# EasyEDA Pro project ESPGI-WIN.eprj, schematic ESPGI

## Sheets
1 GTI: Board Name: ESPGI; Create Date: 2025-03-30; Page Name: GTI; Project Name: ESPGI; Schematic Name: ESPGI; Update Date: 2025-04-27; Company: b4rt; Page Size: A4; Version: V1.0
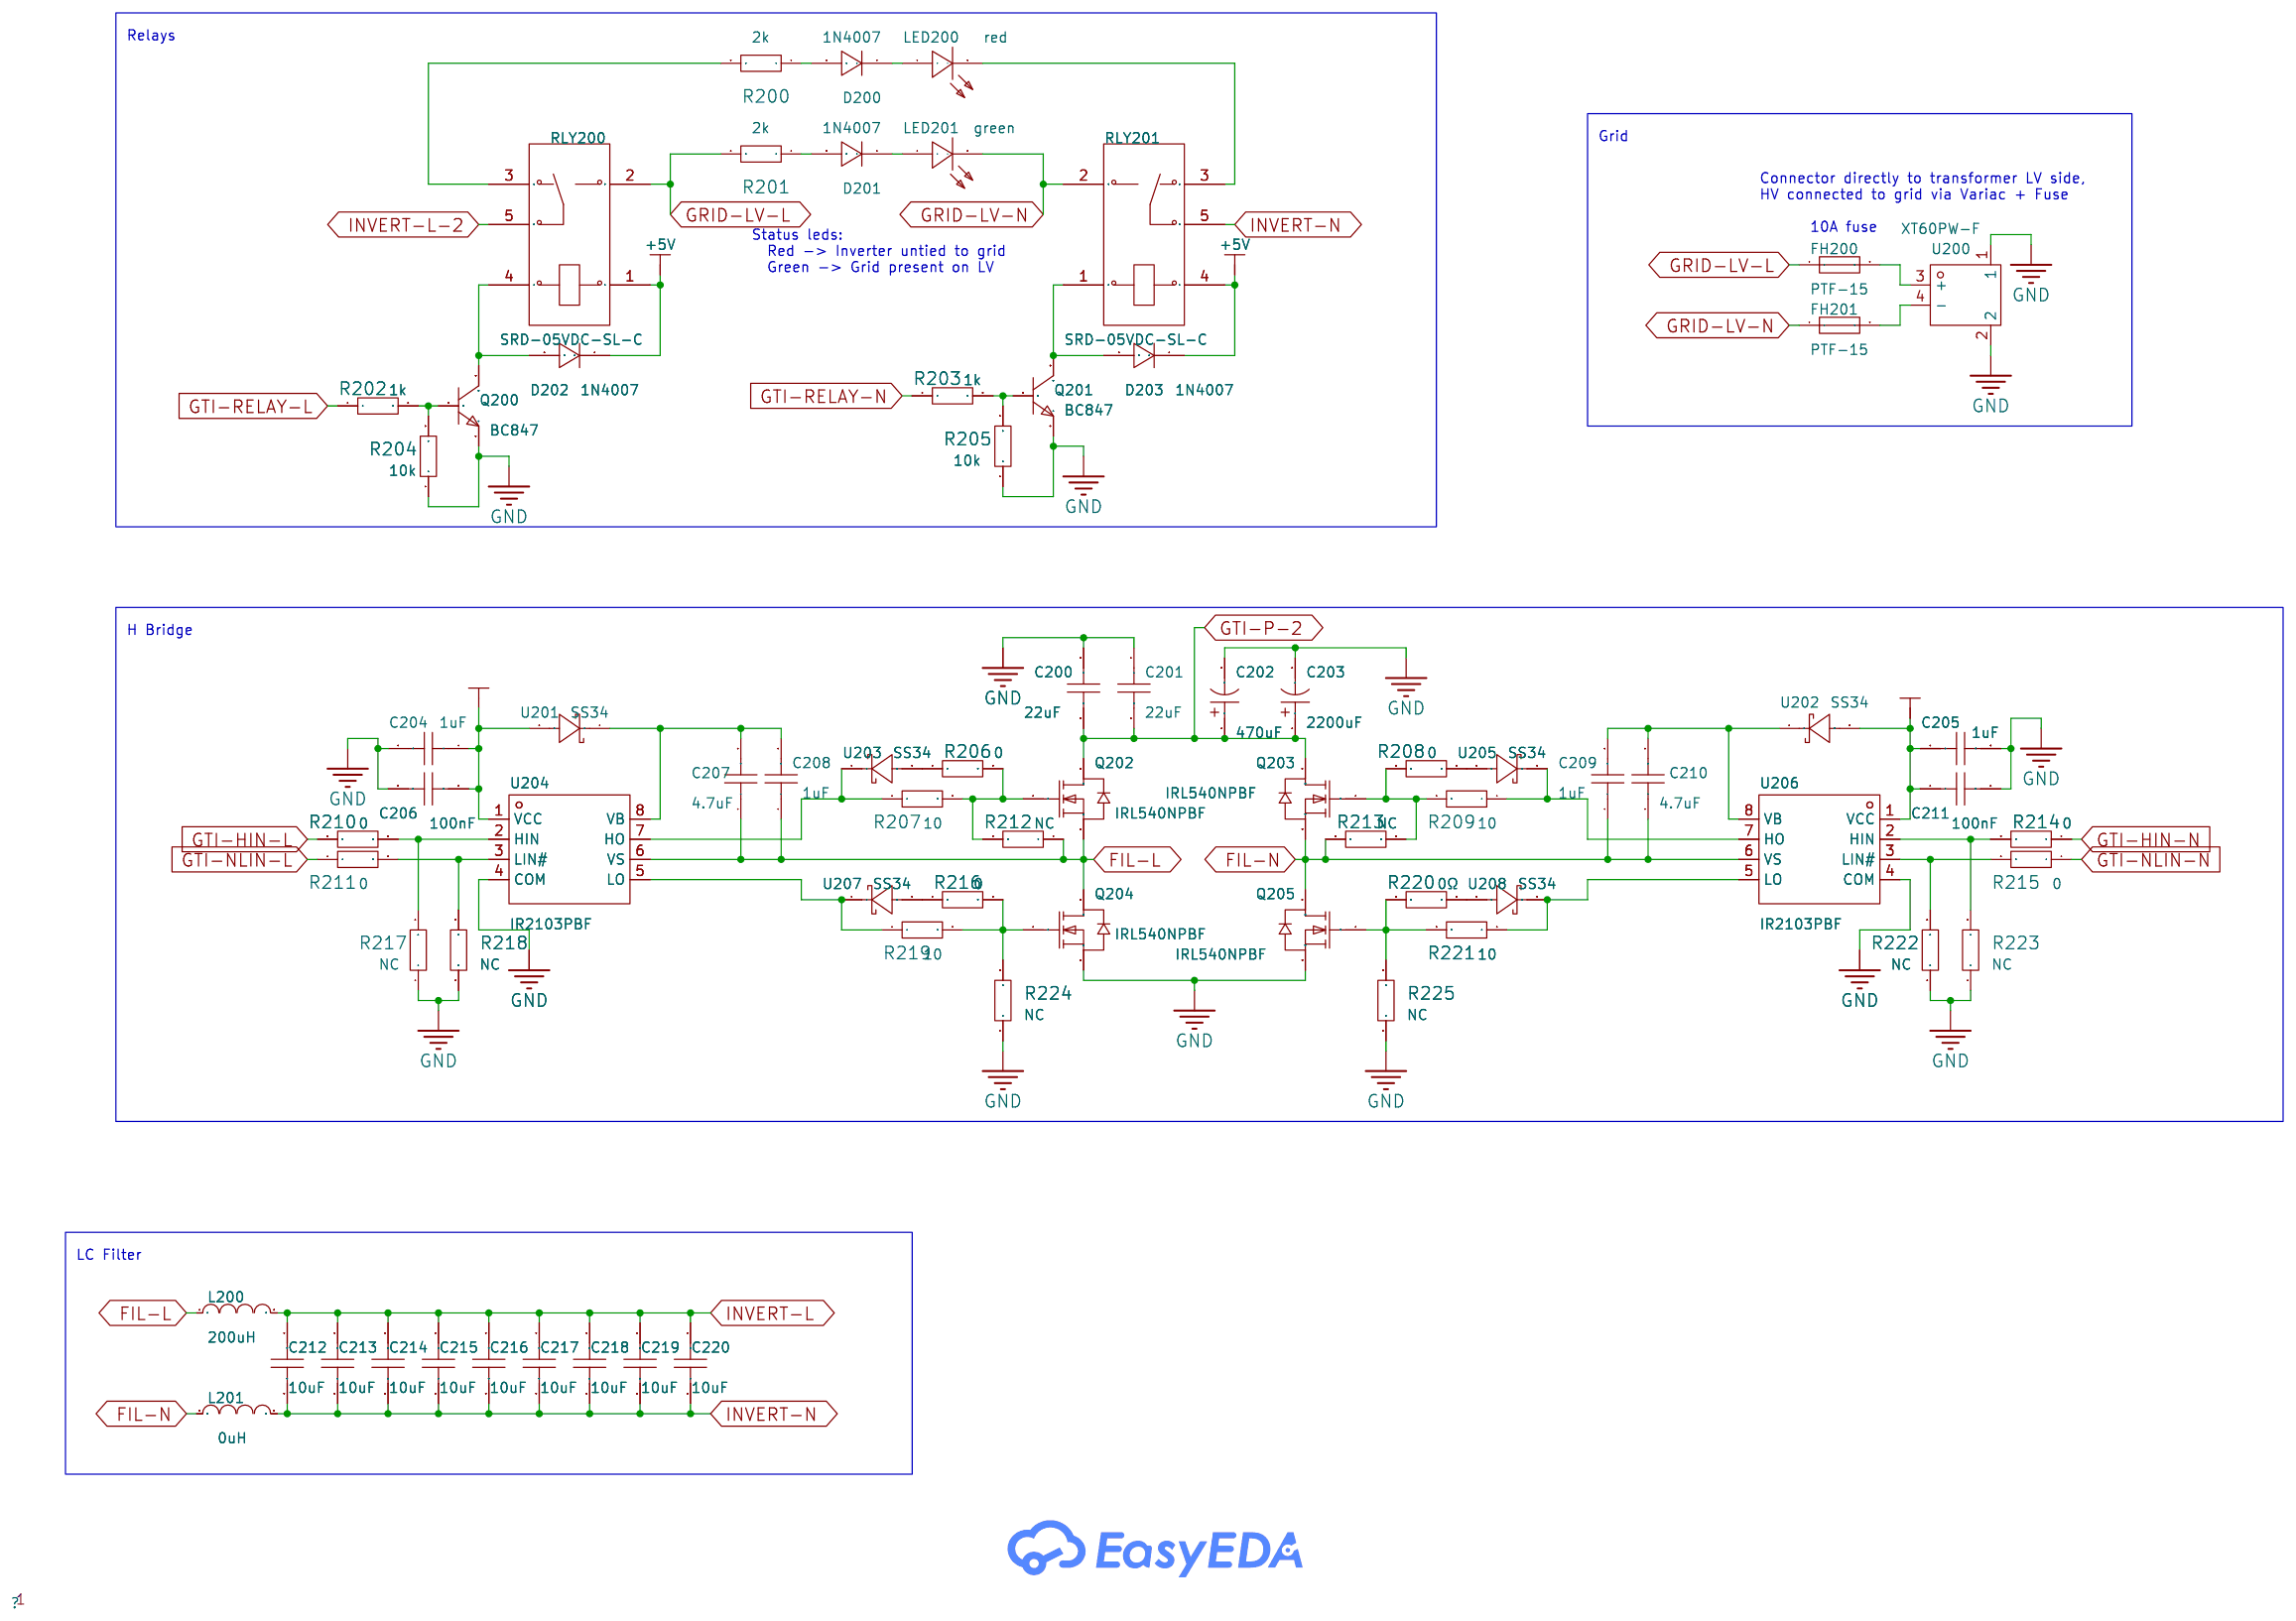
[diagram p0: GTI]
2 GTI-Sensors: Create Date: 2025-05-04; Page Name: GTI-Sensors; Project Name: ESPGI-WIN; Update Date: 2025-05-04; Company: EasyEDA.com
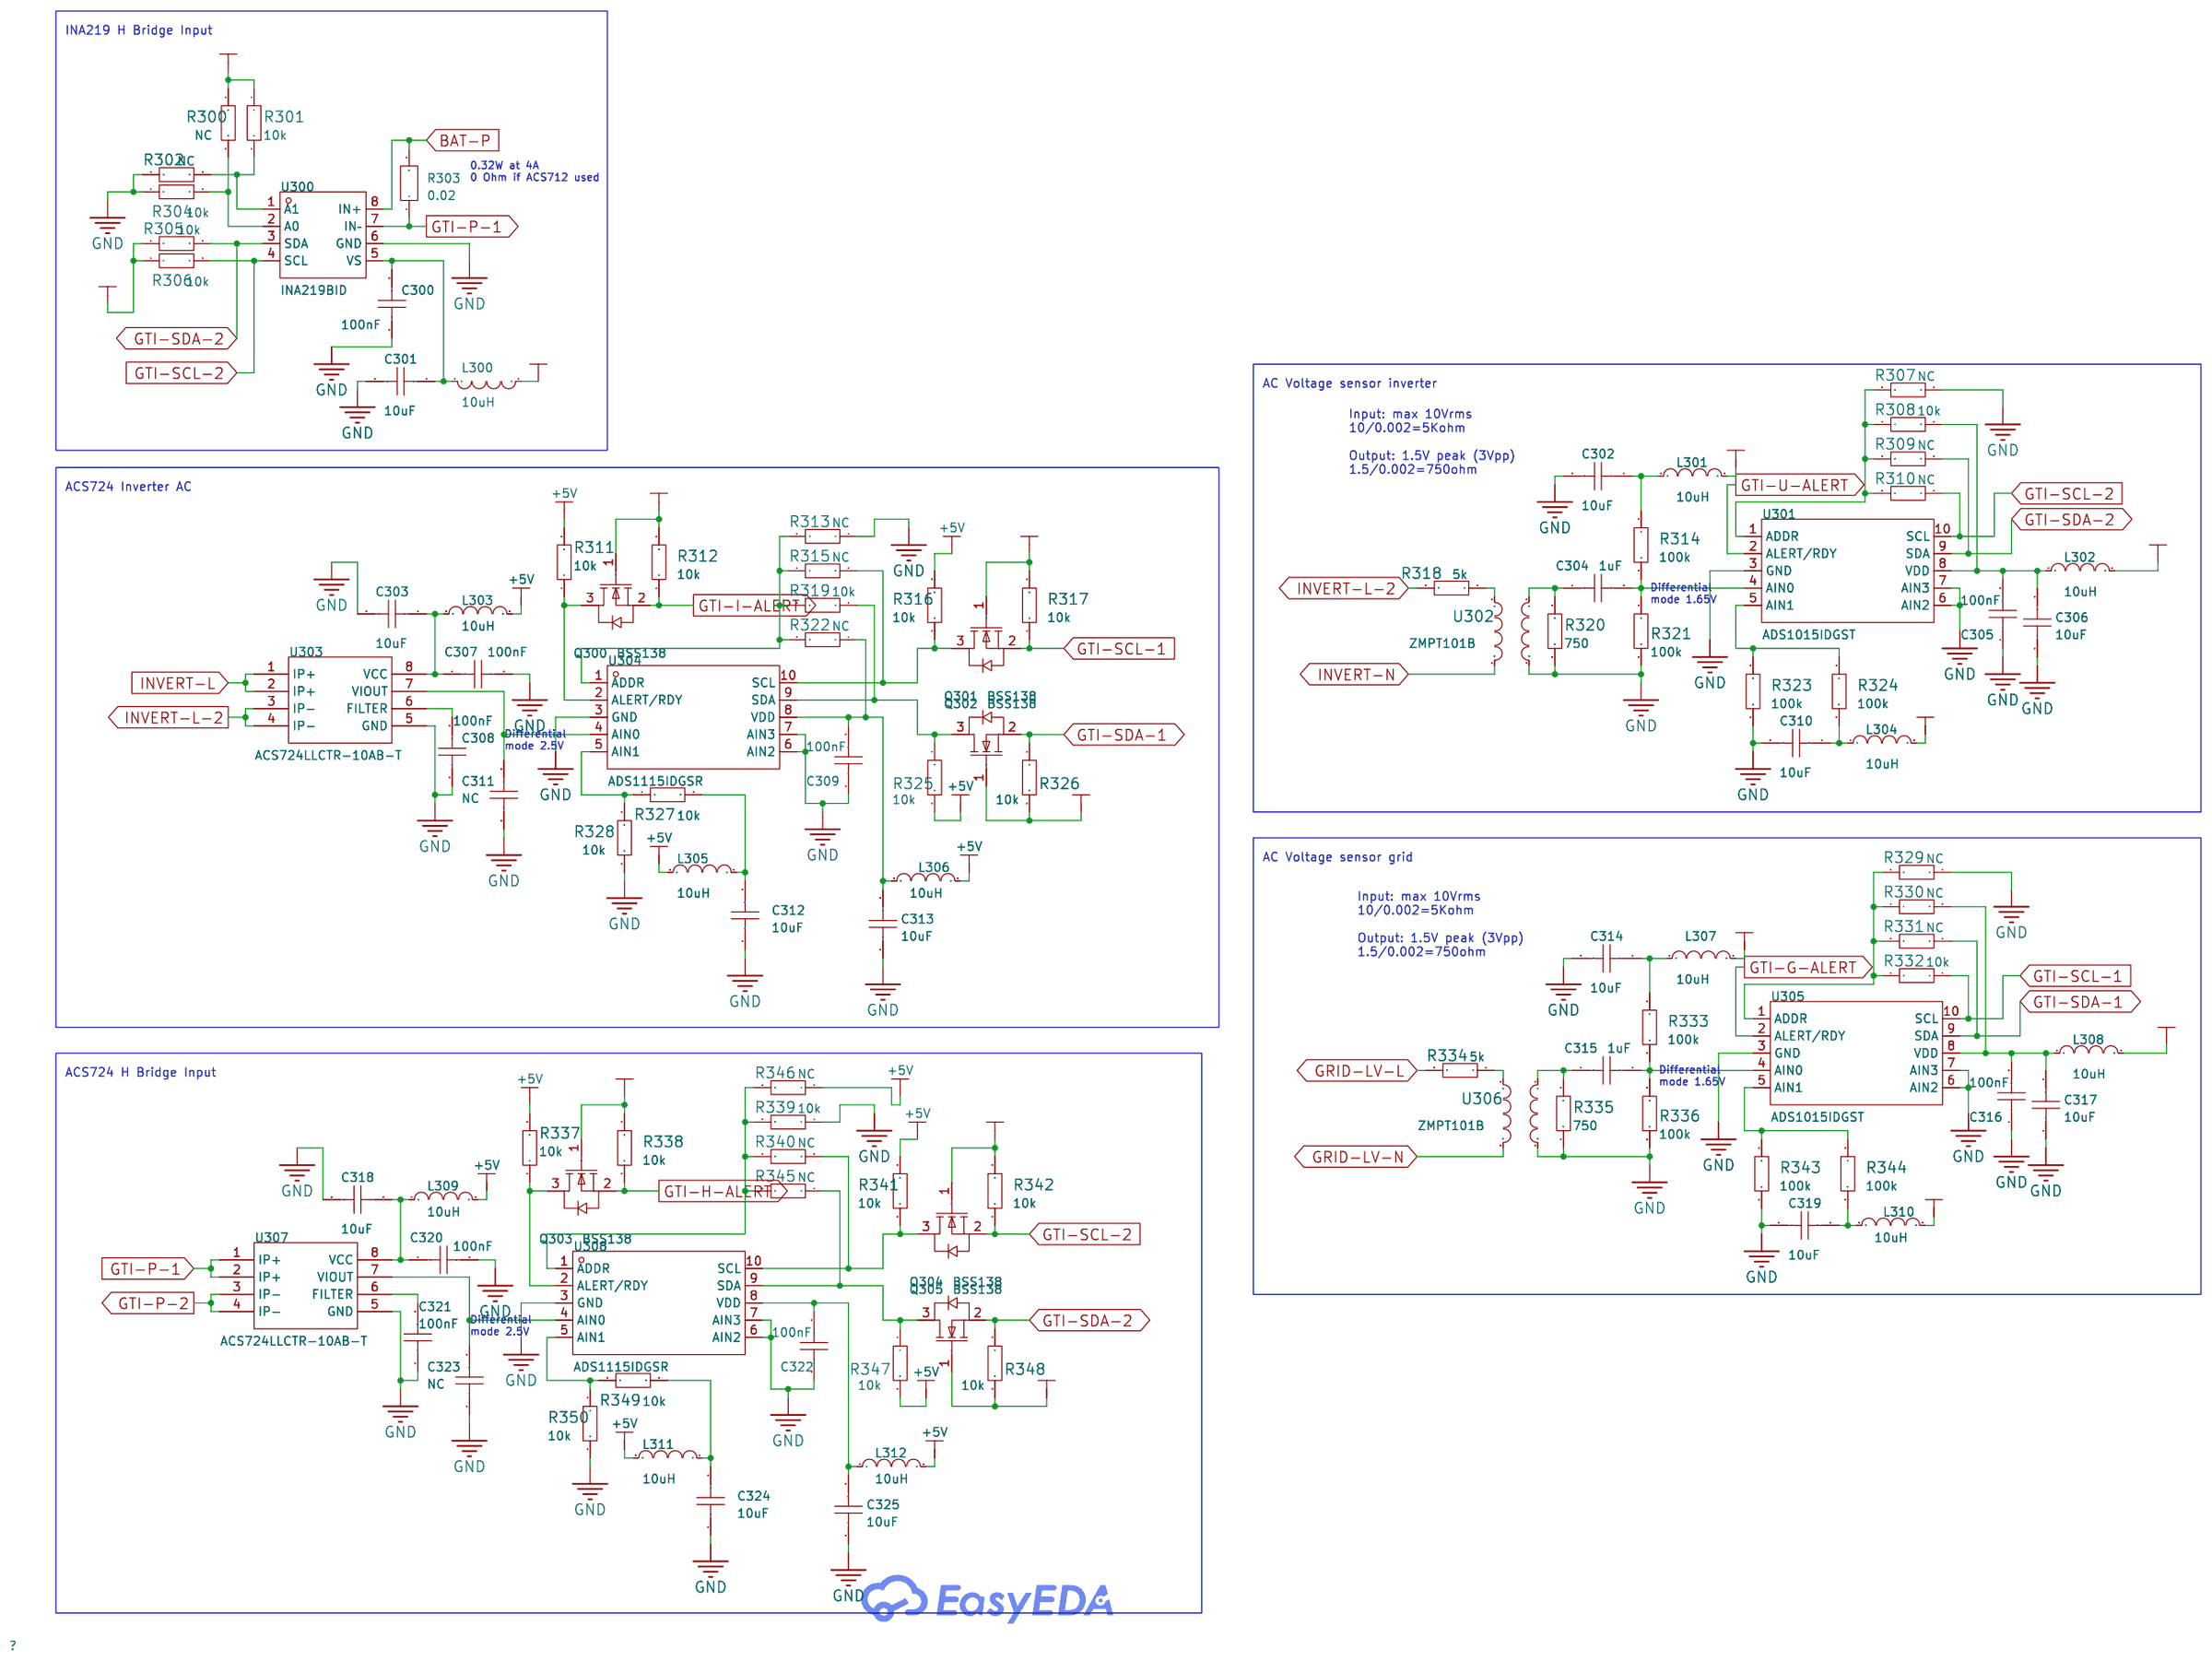
[diagram p1: GTI-Sensors]
3 MCU: Create Date: 2025-04-12; Page Name: MCU; Update Date: 2025-04-26; Company: EasyEDA.com
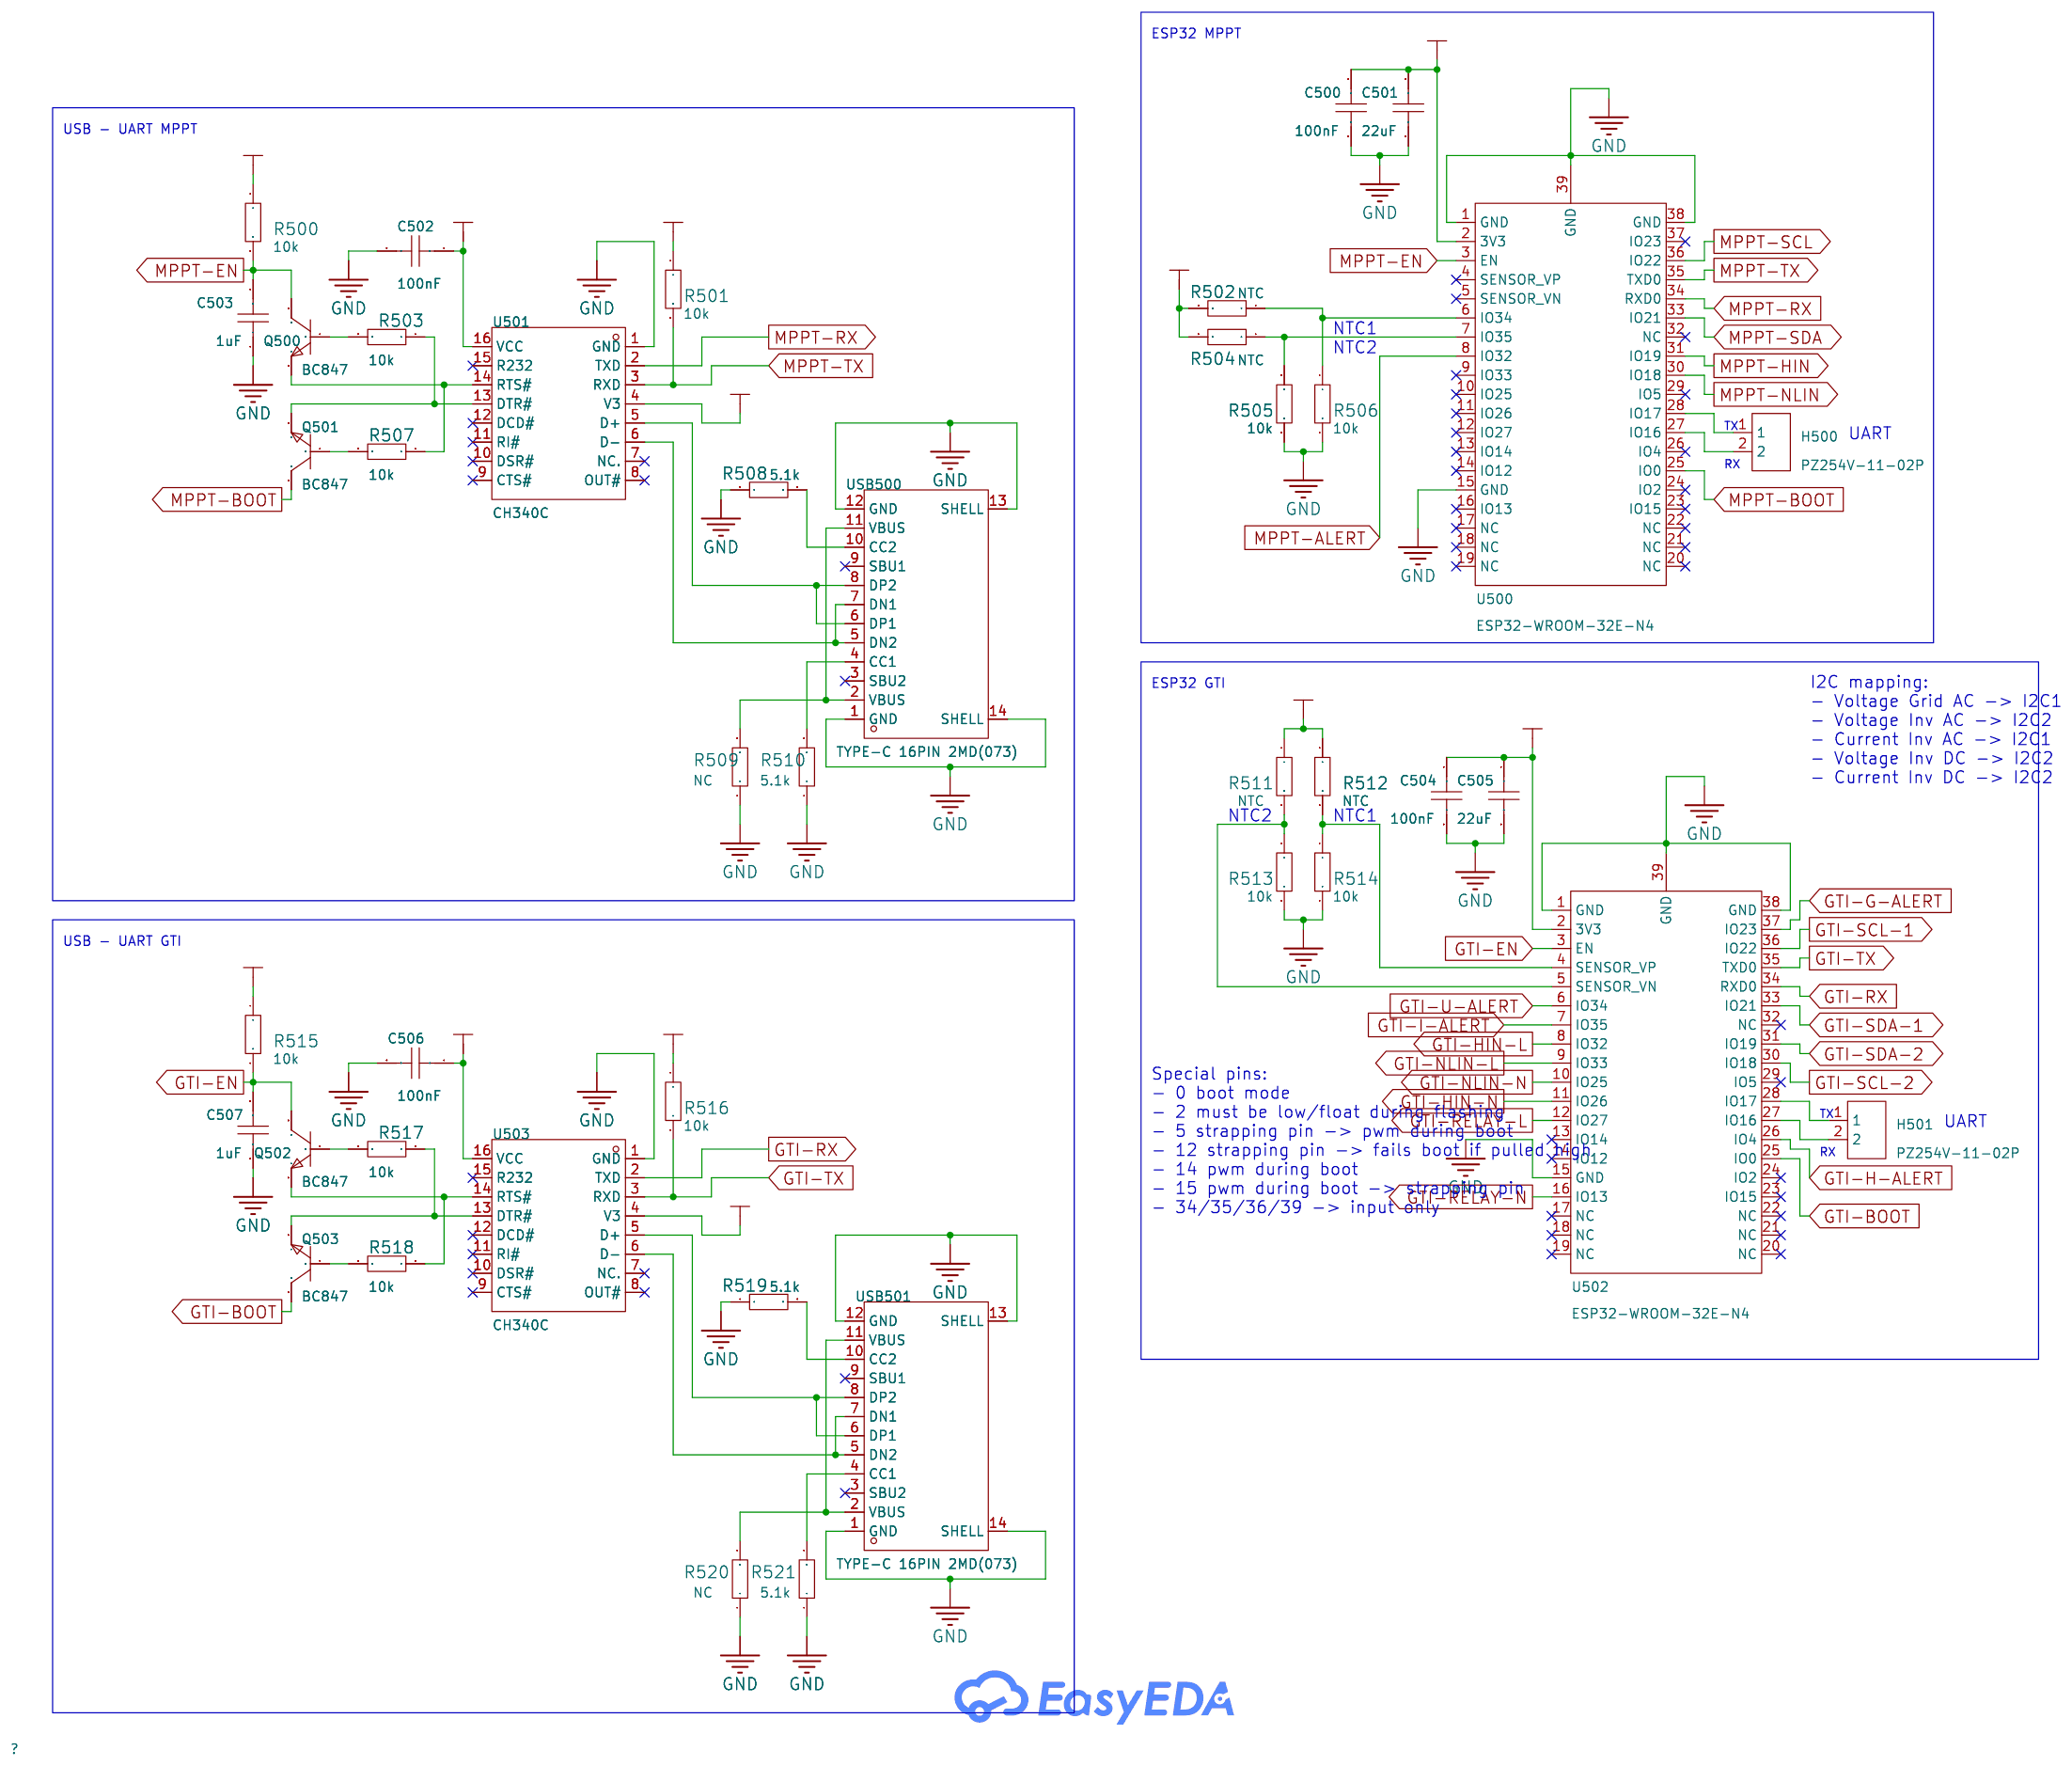
[diagram p2: MCU]
4 MPPT: Create Date: 2025-04-12; Page Name: MPPT; Company: EasyEDA.com
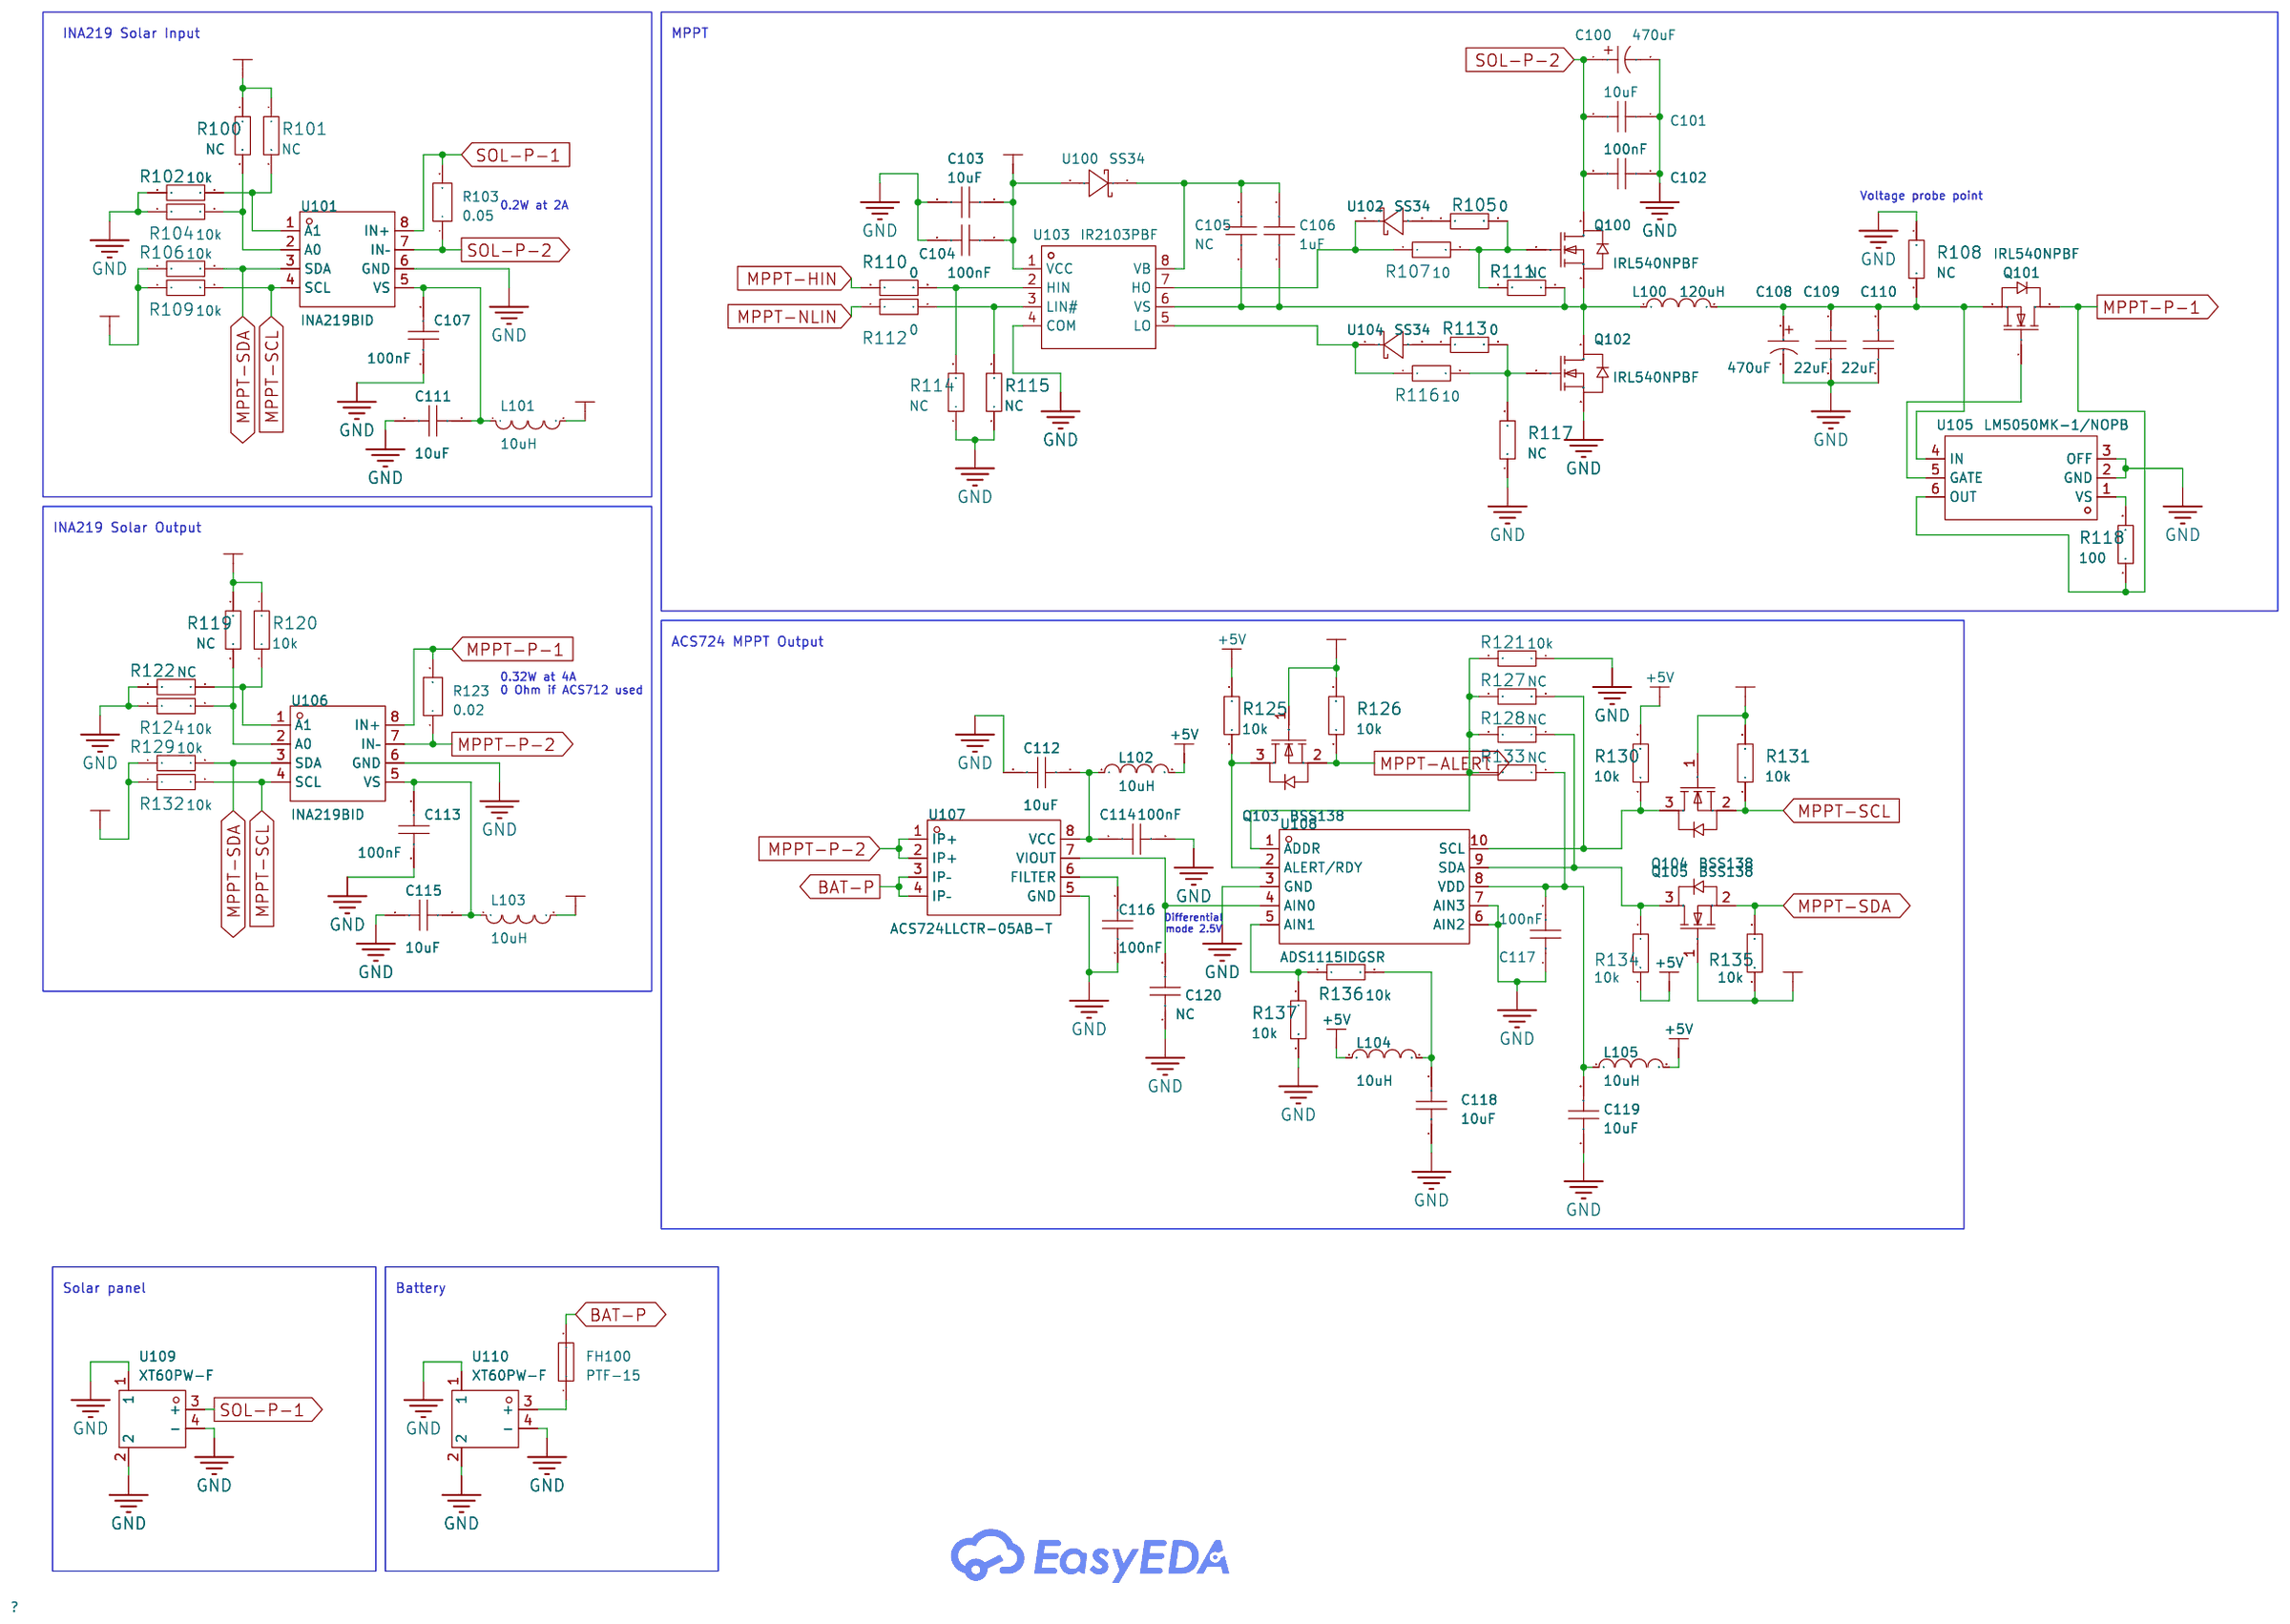
[diagram p3: MPPT]
5 Power: Create Date: 2025-04-12; Page Name: Power; Update Date: 2025-04-23; Company: EasyEDA.com
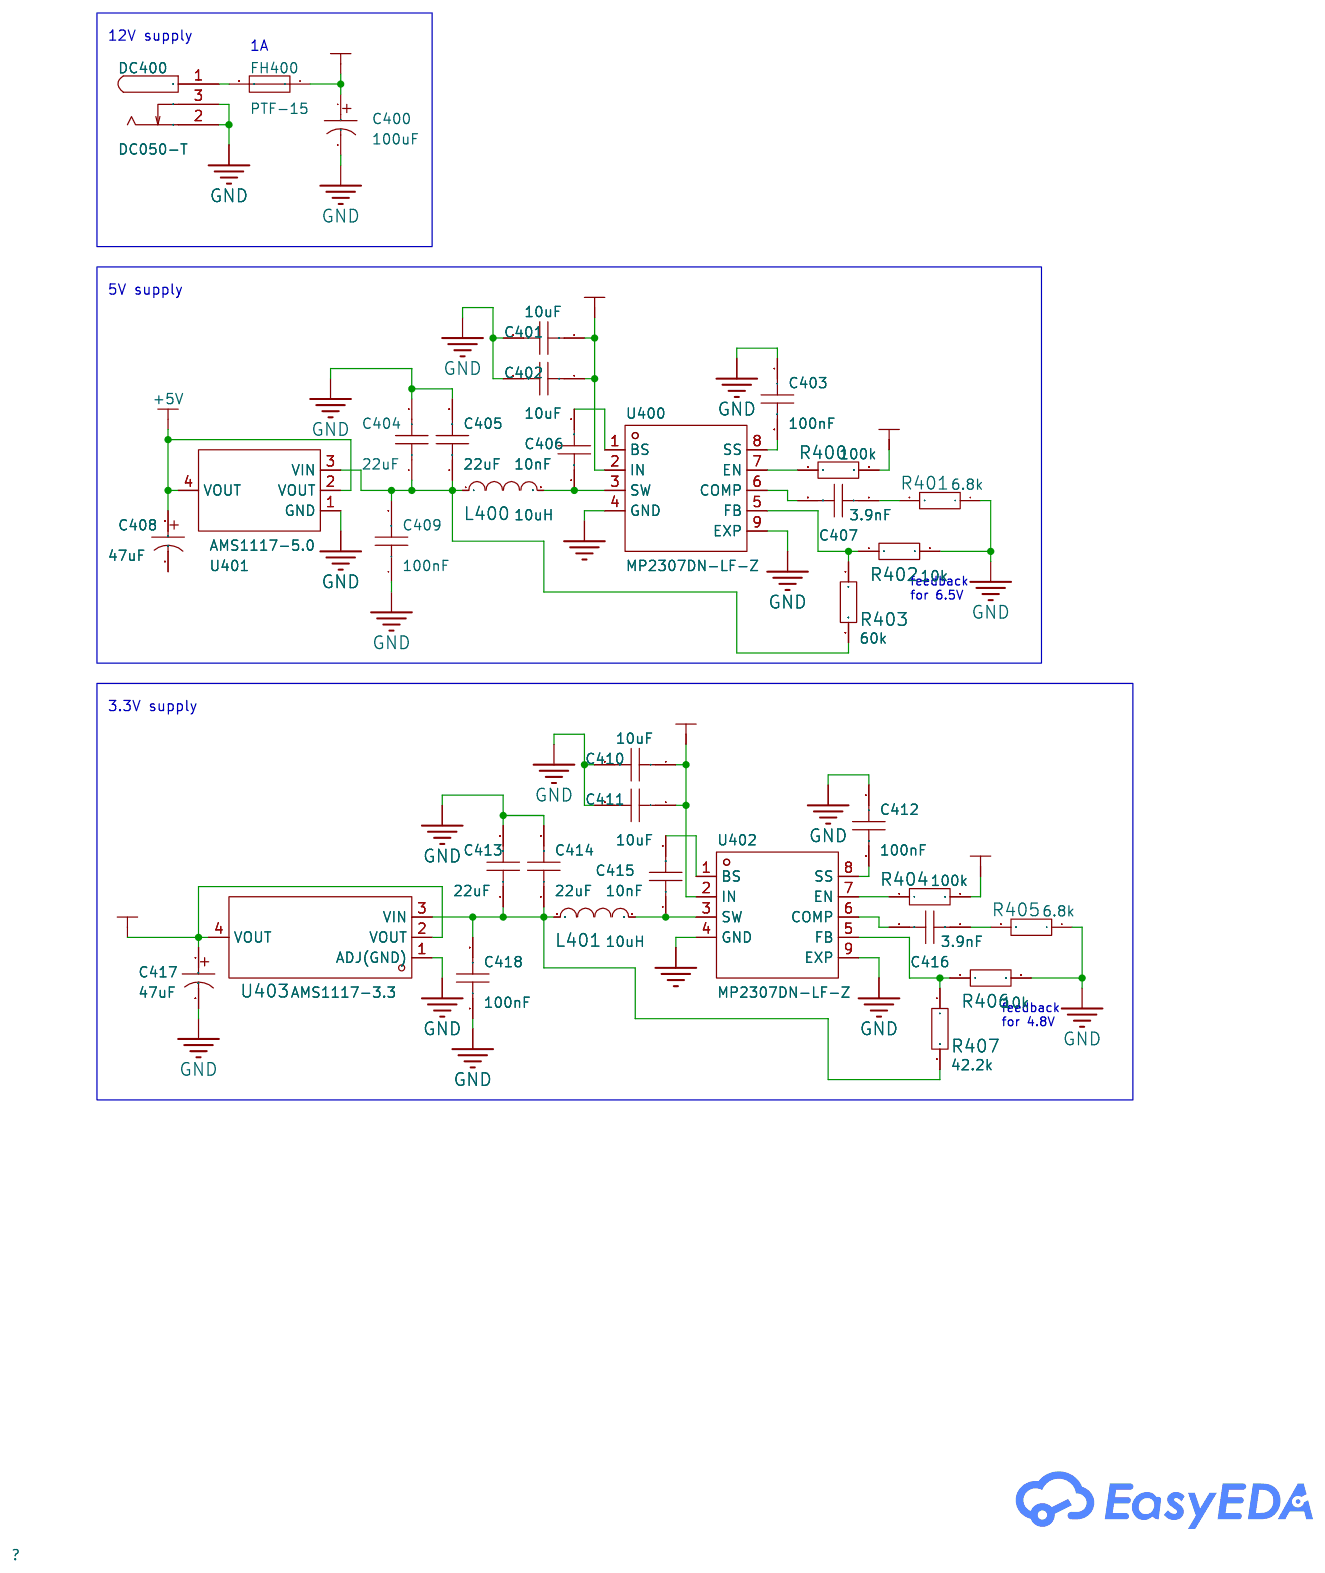
[diagram p4: Power]
6 Block-Diagram: Create Date: 2025-04-26; Page Name: Block-Diagram; Update Date: 2025-04-26; Company: EasyEDA.com
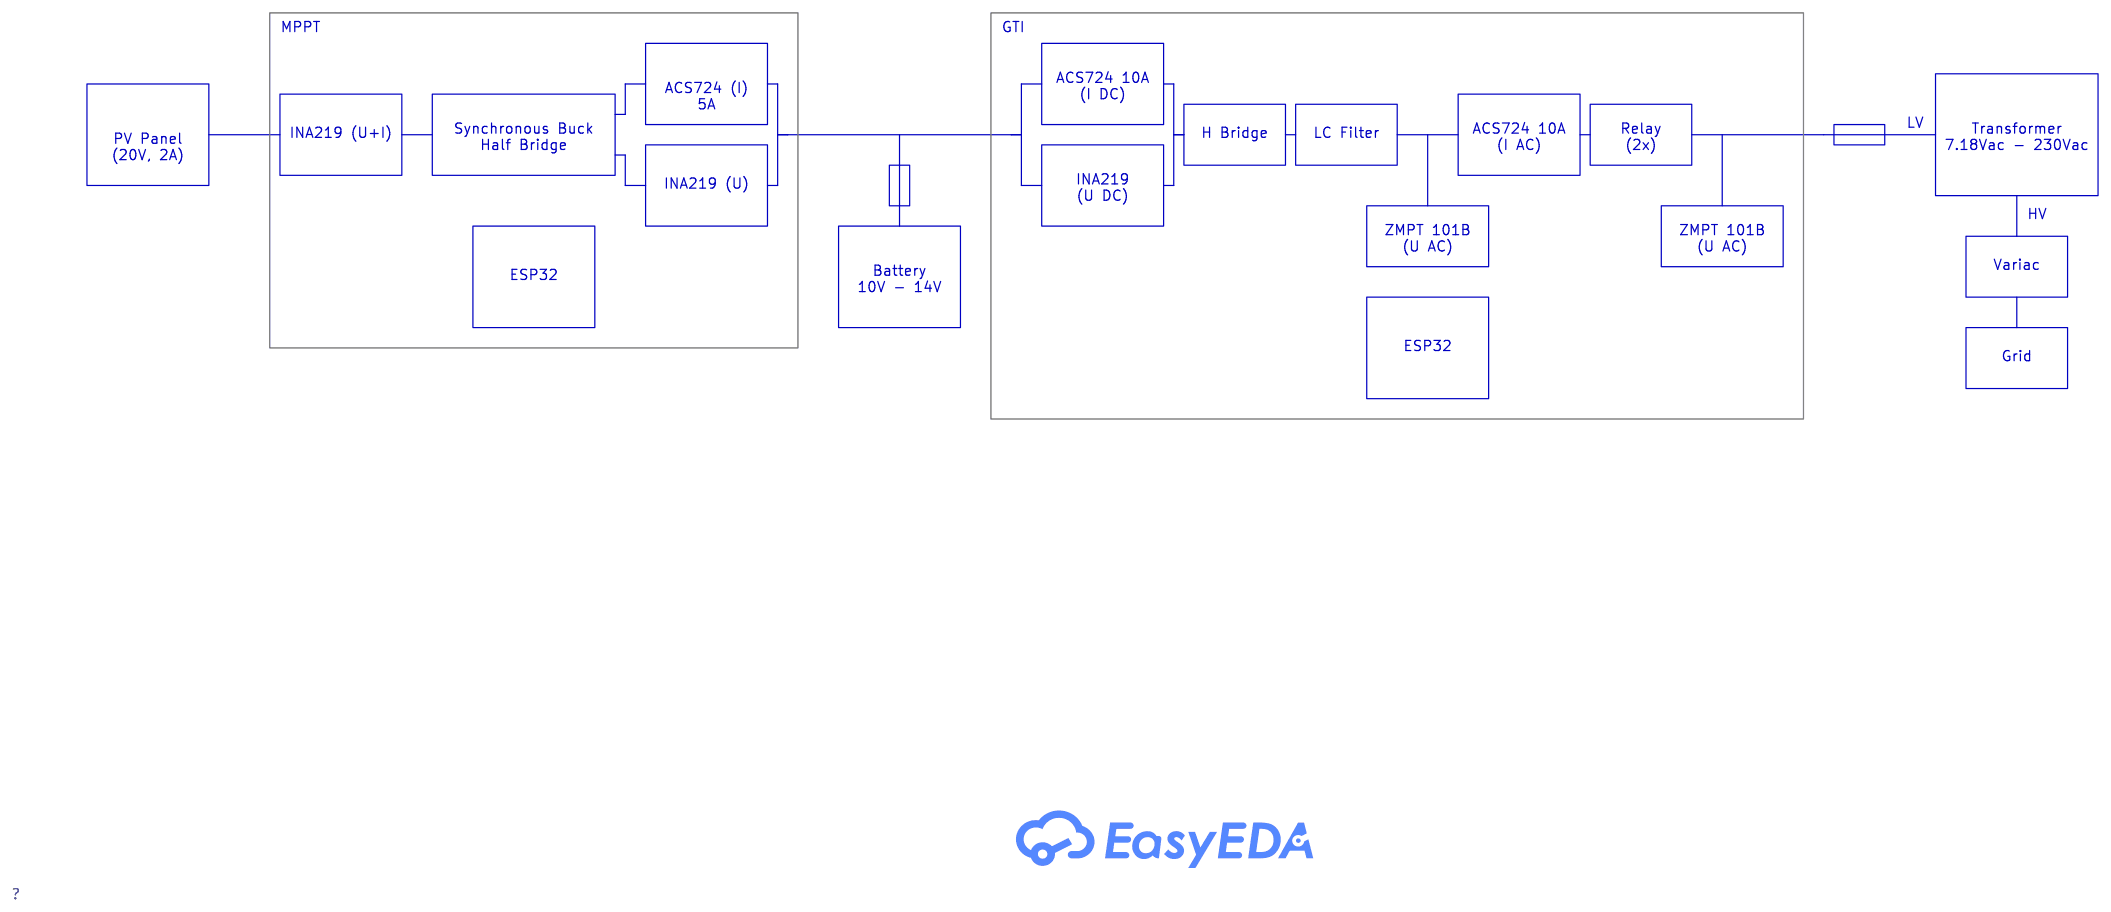
[diagram p5: Block-Diagram]

## Parts
sheet GTI-Sensors
C300  100nF  [C0805]
C301  10uF  [C0805]
C302  10uF  [C0805]
C303  10uF  [C0805]
C304  1uF  [C0805]
C305  100nF  [C0805]
C306  10uF  [C0805]
C307  100nF  [C0805]
C308  100nF  [C0805]
C309  100nF  [C0805]
C310  10uF  [C0805]
C311  NC  [C0805]
C312  10uF  [C0805]
C313  10uF  [C0805]
C314  10uF  [C0805]
C315  1uF  [C0805]
C316  100nF  [C0805]
C317  10uF  [C0805]
C318  10uF  [C0805]
C319  10uF  [C0805]
C320  100nF  [C0805]
C321  100nF  [C0805]
C322  100nF  [C0805]
C323  NC  [C0805]
C324  10uF  [C0805]
C325  10uF  [C0805]
L300  10uH  [L0805]
L301  10uH  [L0805]
L302  10uH  [L0805]
L303  10uH  [L0805]
L304  10uH  [L0805]
L305  10uH  [L0805]
L306  10uH  [L0805]
L307  10uH  [L0805]
L308  10uH  [L0805]
L309  10uH  [L0805]
L310  10uH  [L0805]
L311  10uH  [L0805]
L312  10uH  [L0805]
Q300  BSS138  [SOT-23_L2.9-W1.3-P1.90-LS2.4-BR]
Q301  BSS138  [SOT-23_L2.9-W1.3-P1.90-LS2.4-BR]
Q302  BSS138  [SOT-23_L2.9-W1.3-P1.90-LS2.4-BR]
Q303  BSS138  [SOT-23_L2.9-W1.3-P1.90-LS2.4-BR]
Q304  BSS138  [SOT-23_L2.9-W1.3-P1.90-LS2.4-BR]
Q305  BSS138  [SOT-23_L2.9-W1.3-P1.90-LS2.4-BR]
R300  NC  [R0805]
R301  10k  [R0805]
R302  NC  [R0805]
R303  0.02  [R2512]
R304  10k  [R0805]
R305  10k  [R0805]
R306  10k  [R0805]
R307  NC  [R0805]
R308  10k  [R0805]
R309  NC  [R0805]
R310  NC  [R0805]
R311  10k  [R0805]
R312  10k  [R0805]
R313  NC  [R0805]
R314  100k  [R0805]
R315  NC  [R0805]
R316  10k  [R0805]
R317  10k  [R0805]
R318  5k  [R0805]
R319  10k  [R0805]
R320  750  [R0805]
R321  100k  [R0805]
R322  NC  [R0805]
R323  100k  [R0805]
R324  100k  [R0805]
R325  10k  [R0805]
R326  10k  [R0805]
R327  10k  [R0805]
R328  10k  [R0805]
R329  NC  [R0805]
R330  NC  [R0805]
R331  NC  [R0805]
R332  10k  [R0805]
R333  100k  [R0805]
R334  5k  [R0805]
R335  750  [R0805]
R336  100k  [R0805]
R337  10k  [R0805]
R338  10k  [R0805]
R339  10k  [R0805]
R340  NC  [R0805]
R341  10k  [R0805]
R342  10k  [R0805]
R343  100k  [R0805]
R344  100k  [R0805]
R345  NC  [R0805]
R346  NC  [R0805]
R347  10k  [R0805]
R348  10k  [R0805]
R349  10k  [R0805]
R350  10k  [R0805]
U300  INA219BID  [SOIC-8_L4.9-W3.9-P1.27-LS6.0-BL]
U301  ADS1015IDGST  [VSSOP-10_L3.0-W3.0-P0.50-LS4.9-BL]
U302  ZMPT101B  [XFMR-TH_ZMPT101B]
U303  ACS724LLCTR-10AB-T  [SOIC-8_L4.9-W3.9-P1.27-LS6.0-BL]
U304  ADS1115IDGSR  [MSOP-10_L3.0-W3.0-P0.50-LS5.0-BL]
U305  ADS1015IDGST  [VSSOP-10_L3.0-W3.0-P0.50-LS4.9-BL]
U306  ZMPT101B  [XFMR-TH_ZMPT101B]
U307  ACS724LLCTR-10AB-T  [SOIC-8_L4.9-W3.9-P1.27-LS6.0-BL]
U308  ADS1115IDGSR  [MSOP-10_L3.0-W3.0-P0.50-LS5.0-BL]
sheet GTI
C200  22uF  [C0805]
C201  22uF  [C0805]
C202  470uF  [CAP-TH_BD13.0-P5.00-D0.6-FD]
C203  2200uF  [CAP-TH_BD13.0-P5.00-D0.6-FD]
C204  1uF  [C0805]
C205  1uF  [C0805]
C206  100nF  [C0805]
C207  4.7uF  [C0805]
C208  1uF  [C0805]
C209  1uF  [C0805]
C210  4.7uF  [C0805]
C211  100nF  [C0805]
C212  10uF  [C0805]
C213  10uF  [C0805]
C214  10uF  [C0805]
C215  10uF  [C0805]
C216  10uF  [C0805]
C217  10uF  [C0805]
C218  10uF  [C0805]
C219  10uF  [C0805]
C220  10uF  [C0805]
D200  1N4007  [SMA_L4.4-W2.8-LS5.4-RD]
D201  1N4007  [SMA_L4.4-W2.8-LS5.4-RD]
D202  1N4007  [SMA_L4.4-W2.8-LS5.4-RD]
D203  1N4007  [SMA_L4.4-W2.8-LS5.4-RD]
FH200  PTF-15  [FUSE-TH_L22.0-W9.0-P22.60]
FH201  PTF-15  [FUSE-TH_L22.0-W9.0-P22.60]
L200  200uH  [IND-TH_XR6826T471MHL6]
L201  0uH  [IND-TH_XR6826T471MHL6]
LED200  red  [LED0805-R-RD]
LED201  green  [LED0805-R-RD]
Q200  BC847  [SOT-23-3_L2.9-W1.3-P1.90-LS2.4-BR]
Q201  BC847  [SOT-23-3_L2.9-W1.3-P1.90-LS2.4-BR]
Q202  IRL540NPBF  [TO-220-3_L10.0-W4.5-P2.54-T]
Q203  IRL540NPBF  [TO-220-3_L10.0-W4.5-P2.54-T]
Q204  IRL540NPBF  [TO-220-3_L10.0-W4.5-P2.54-T]
Q205  IRL540NPBF  [TO-220-3_L10.0-W4.5-P2.54-T]
R200  2k  [R0805]
R201  2k  [R0805]
R202  1k  [R0805]
R203  1k  [R0805]
R204  10k  [R0805]
R205  10k  [R0805]
R206  0  [R0805]
R207  10  [R0805]
R208  0  [R0805]
R209  10  [R0805]
R210  0  [R0805]
R211  0  [R0805]
R212  NC  [R0805]
R213  NC  [R0805]
R214  0  [R0805]
R215  0  [R0805]
R216  0  [R0805]
R217  NC  [R0805]
R218  NC  [R0805]
R219  10  [R0805]
R220  0Ω  [R0805]
R221  10  [R0805]
R222  NC  [R0805]
R223  NC  [R0805]
R224  NC  [R0805]
R225  NC  [R0805]
RLY200  SRD-05VDC-SL-C  [RELAY-TH_SRD-XXVDC-XL-C]
RLY201  SRD-05VDC-SL-C  [RELAY-TH_SRD-XXVDC-XL-C]
U200  XT60PW-F  [TH_2P-XT60PW-F]
U201  SS34  [SMA_L4.3-W2.6-LS5.1-RD]
U202  SS34  [SMA_L4.3-W2.6-LS5.1-RD]
U203  SS34  [SMA_L4.3-W2.6-LS5.1-RD]
U204  IR2103PBF  [DIP-8_L9.8-W6.6-P2.54-LS7.6-BL]
U205  SS34  [SMA_L4.3-W2.6-LS5.1-RD]
U206  IR2103PBF  [DIP-8_L9.8-W6.6-P2.54-LS7.6-BL]
U207  SS34  [SMA_L4.3-W2.6-LS5.1-RD]
U208  SS34  [SMA_L4.3-W2.6-LS5.1-RD]
sheet MCU
C500  100nF  [C0805]
C501  22uF  [C0805]
C502  100nF  [C0805]
C503  1uF  [C0805]
C504  100nF  [C0805]
C505  22uF  [C0805]
C506  100nF  [C0805]
C507  1uF  [C0805]
H500  PZ254V-11-02P  [HDR-TH_2P-P2.54-V-M]
H501  PZ254V-11-02P  [HDR-TH_2P-P2.54-V-M]
Q500  BC847  [SOT-23-3_L2.9-W1.3-P1.90-LS2.4-BR]
Q501  BC847  [SOT-23-3_L2.9-W1.3-P1.90-LS2.4-BR]
Q502  BC847  [SOT-23-3_L2.9-W1.3-P1.90-LS2.4-BR]
Q503  BC847  [SOT-23-3_L2.9-W1.3-P1.90-LS2.4-BR]
R500  10k  [R0805]
R501  10k  [R0805]
R502  NTC  [R0805]
R503  10k  [R0805]
R504  NTC  [R0805]
R505  10k  [R0805]
R506  10k  [R0805]
R507  10k  [R0805]
R508  5.1k  [R0805]
R509  NC  [R0805]
R510  5.1k  [R0805]
R511  NTC  [R0805]
R512  NTC  [R0805]
R513  10k  [R0805]
R514  10k  [R0805]
R515  10k  [R0805]
R516  10k  [R0805]
R517  10k  [R0805]
R518  10k  [R0805]
R519  5.1k  [R0805]
R520  NC  [R0805]
R521  5.1k  [R0805]
U500  ESP32-WROOM-32E-N4  [WIFI-SMD_ESP32-WROOM-32E]
U501  CH340C  [SOP-16_L10.0-W3.9-P1.27-LS6.0-BL]
U502  ESP32-WROOM-32E-N4  [WIFI-SMD_ESP32-WROOM-32E]
U503  CH340C  [SOP-16_L10.0-W3.9-P1.27-LS6.0-BL]
USB500  TYPE-C 16PIN 2MD(073)  [USB-C-SMD_TYPE-C-6PIN-2MD-073]
USB501  TYPE-C 16PIN 2MD(073)  [USB-C-SMD_TYPE-C-6PIN-2MD-073]
sheet MPPT
C100  470uF  [CAP-TH_BD13.0-P5.00-D0.6-FD]
C101  10uF  [C0805]
C102  100nF  [C0805]
C103  10uF  [C0805]
C104  100nF  [C0805]
C105  NC  [C0805]
C106  1uF  [C0805]
C107  100nF  [C0805]
C108  470uF  [CAP-TH_BD8.0-P3.50-D0.6-FD]
C109  22uF  [C0805]
C110  22uF  [C0805]
C111  10uF  [C0805]
C112  10uF  [C0805]
C113  100nF  [C0805]
C114  100nF  [C0805]
C115  10uF  [C0805]
C116  100nF  [C0805]
C117  100nF  [C0805]
C118  10uF  [C0805]
C119  10uF  [C0805]
C120  NC  [C0805]
FH100  PTF-15  [FUSE-TH_L22.0-W9.0-P22.60]
L100  120uH  [IND-TH_XR6826T471MHL6]
L101  10uH  [L0805]
L102  10uH  [L0805]
L103  10uH  [L0805]
L104  10uH  [L0805]
L105  10uH  [L0805]
Q100  IRL540NPBF  [TO-220-3_L10.0-W4.5-P2.54-T]
Q101  IRL540NPBF  [TO-220-3_L10.0-W4.5-P2.54-T]
Q102  IRL540NPBF  [TO-220-3_L10.0-W4.5-P2.54-T]
Q103  BSS138  [SOT-23_L2.9-W1.3-P1.90-LS2.4-BR]
Q104  BSS138  [SOT-23_L2.9-W1.3-P1.90-LS2.4-BR]
Q105  BSS138  [SOT-23_L2.9-W1.3-P1.90-LS2.4-BR]
R100  NC  [R0805]
R101  NC  [R0805]
R102  10k  [R0805]
R103  0.05  [R2512]
R104  10k  [R0805]
R105  0  [R0805]
R106  10k  [R0805]
R107  10  [R0805]
R108  NC  [R0805]
R109  10k  [R0805]
R110  0  [R0805]
R111  NC  [R0805]
R112  0  [R0805]
R113  0  [R0805]
R114  NC  [R0805]
R115  NC  [R0805]
R116  10  [R0805]
R117  NC  [R0805]
R118  100  [R0805]
R119  NC  [R0805]
R120  10k  [R0805]
R121  10k  [R0805]
R122  NC  [R0805]
R123  0.02  [R2512]
R124  10k  [R0805]
R125  10k  [R0805]
R126  10k  [R0805]
R127  NC  [R0805]
R128  NC  [R0805]
R129  10k  [R0805]
R130  10k  [R0805]
R131  10k  [R0805]
R132  10k  [R0805]
R133  NC  [R0805]
R134  10k  [R0805]
R135  10k  [R0805]
R136  10k  [R0805]
R137  10k  [R0805]
U100  SS34  [SMA_L4.3-W2.6-LS5.1-RD]
U101  INA219BID  [SOIC-8_L4.9-W3.9-P1.27-LS6.0-BL]
U102  SS34  [SMA_L4.3-W2.6-LS5.1-RD]
U103  IR2103PBF  [DIP-8_L9.8-W6.6-P2.54-LS7.6-BL]
U104  SS34  [SMA_L4.3-W2.6-LS5.1-RD]
U105  LM5050MK-1/NOPB  [TSOT-23-6_L2.9-W1.6-P0.95-LS2.8-BR]
U106  INA219BID  [SOIC-8_L4.9-W3.9-P1.27-LS6.0-BL]
U107  ACS724LLCTR-05AB-T  [SOIC-8_L4.9-W3.9-P1.27-LS6.0-BL]
U108  ADS1115IDGSR  [MSOP-10_L3.0-W3.0-P0.50-LS5.0-BL]
U109  XT60PW-F  [TH_2P-XT60PW-F]
U110  XT60PW-F  [TH_2P-XT60PW-F]
sheet Power
C400  100uF  [CAP-TH_BD8.0-P3.50-D0.6-FD]
C401  10uF  [C0805]
C402  10uF  [C0805]
C403  100nF  [C0805]
C404  22uF  [C0805]
C405  22uF  [C0805]
C406  10nF  [C0805]
C407  3.9nF  [C0805]
C408  47uF  [CAP-TH_BD8.0-P3.50-D0.6-FD]
C409  100nF  [C0805]
C410  10uF  [C0805]
C411  10uF  [C0805]
C412  100nF  [C0805]
C413  22uF  [C0805]
C414  22uF  [C0805]
C415  10nF  [C0805]
C416  3.9nF  [C0805]
C417  47uF  [CAP-TH_BD8.0-P3.50-D0.6-FD]
C418  100nF  [C0805]
DC400  DC050-T  [DC-IN_DC050-T]
FH400  PTF-15  [FUSE-TH_L22.0-W9.0-P22.60]
L400  10uH  [IND-SMD_L7.5-W7.5]
L401  10uH  [IND-SMD_L7.5-W7.5]
R400  100k  [R0805]
R401  6.8k  [R0805]
R402  10k  [R0805]
R403  60k  [R0805]
R404  100k  [R0805]
R405  6.8k  [R0805]
R406  10k  [R0805]
R407  42.2k  [R0805]
U400  MP2307DN-LF-Z  [SOP-8_L4.9-W3.9-P1.27-LS6.0-BL-EP]
U401  AMS1117-5.0  [SOT-223-3_L6.7-W3.7-P2.30-LS7.0-BR]
U402  MP2307DN-LF-Z  [SOP-8_L4.9-W3.9-P1.27-LS6.0-BL-EP]
U403  AMS1117-3.3  [SOT-223-3_L6.5-W3.4-P2.30-LS7.0-BR]

## Library data of the parts
C101-C107 C109-C120 C200 C201 C204-C220 C300-C325 C401-C407 C409-C416 C418 C500-C507 = MBK0805X7R104K500NT: Capacitance: Voltage Rated: Temperature Coefficient:; LCSC Part Name: 100nF 50V; Supplier Part: C2830721; Manufacturer: FH-BK(风华邦科); Supplier Footprint: 0805; JLCPCB Part Class: Extended Part; Datasheet: https://atta.szlcsc.com/upload/public/pdf/source/20210427/C2830703_E1E3E2CFFA21ECBD84F9CFD2C7D2B314.pdf; Supplier: LCSC
L101-L105 L300-L312 = MGFL2012F100MT-LF: Inductance: Tolerance:±20% Tolerance:±20% Rated Current: Saturation Current (Isat):- DC Resistance (DCR): Q @ Freq:- Frequency - Self Resonant:- Ratings:; LCSC Part Name: 10uH ±20%; Supplier Part: C281113; Manufacturer: microgate(麦捷科技); Supplier Footprint: 0805; JLCPCB Part Class: Extended Part; Datasheet: https://atta.szlcsc.com/upload/public/pdf/source/20181025/C281113_18633E3AF8F2E9832A865B8532475DE8.pdf; Supplier: LCSC; Tolerance: ±20%
Q103-Q105 Q300-Q305 = BSS138_C5279927: Type:1 N-channel Drain to Source Voltage:50V Current - Continuous Drain(Id):220mA RDS(on):6Ω@4.5V,0.22A Pd - Power Dissipation:350mW Gate Threshold Voltage (Vgs(th)@Id):1.5V Input Capacitance(Ciss@Vds):27pF@25V Reverse Transfer Capacitance (Crss@Vds):6pF@; LCSC Part Name: N沟道,电流:0.22A,耐压:50V; Supplier Part: C5279927; Manufacturer: JUXING(钜兴); Supplier Footprint: SOT-23; JLCPCB Part Class: Extended Part; Datasheet: https://atta.szlcsc.com/upload/public/pdf/source/20221123/5F5B8F5E796F92BEAD80584DB31FBE73.pdf; Supplier: LCSC; Type: 1 N-channel; Drain to Source Voltage: 50V; Current - Continuous Drain(Id): 220mA; RDS(on): 6Ω@4.5V,0.22A; Pd - Power Dissipation: 350mW; Gate Threshold Voltage (Vgs(th)@Id): 1.5V; Input Capacitance(Ciss@Vds): 27pF@25V; Reverse Transfer Capacitance (Crss@Vds): 6pF@25V; Operating Temperature: -50℃~+150℃
R100-R102 R104 R106-R109 R111 R114-R122 R124-R137 R200-R205 R207 R209 R212 R213 R217-R219 R221-R225 R300-R302 R304-R350 R400-R407 R500-R521 = RMC080510K1%N: Resistance: Tolerance:±1% Tolerance:±1% Power(Watts):; LCSC Part Name: 10kΩ ±1% 125mW; Supplier Part: C269742; Manufacturer: Tyohm(幸亚电阻); Supplier Footprint: 0805; JLCPCB Part Class: Extended Part; Datasheet: https://atta.szlcsc.com/upload/public/pdf/source/20190115/C325956_D27151D492FFB3C9AB4A6F14FE01F30A.pdf; Supplier: LCSC; Tolerance: ±1%
R103 R123 R303 = SY2512CJR100: Resistance: Tolerance:±5% Tolerance:±5% Power(Watts): Temperature Coefficient:±50ppm/℃ Temperature Coefficient:±50ppm/℃; LCSC Part Name: 100mΩ ±5% 3W; Supplier Part: C466830; Manufacturer: SANYEAR(叁叶源); Supplier Footprint: 2512; JLCPCB Part Class: Extended Part; Datasheet: https://atta.szlcsc.com/upload/public/pdf/source/20191118/C457148_6D0C0C52E1D75A92E2420E79815D2212.pdf; Supplier: LCSC; Tolerance: ±5%; Temperature Coefficient: ±50ppm/℃
U101 U106 U300 = INA219BID: LCSC Part Name: 具有I2C接口的零漂移双向电流/功率监测计; Supplier Part: C2859699; Manufacturer: TI(德州仪器); Supplier Footprint: SOIC-8; JLCPCB Part Class: Extended Part; Datasheet: https://www.ti.com/cn/lit/gpn/ina219; Supplier: LCSC
U301 U305 = ADS1015IDGST: resolution:12 Bits sampling frequency:3300Hz number of channels:4 Supply Voltage:2V~5.5V Supply Voltage:2V~5.5V Interface:I2C differential input:Yes Integral nonlinearity:0.5LSB Integral nonlinearity:0.5LSB Operating Temperature:-40℃~+125℃ Operating Tempe; Supplier Part: C701606; Manufacturer: TI(德州仪器); Supplier Footprint: VSSOP-10-0.5mm; JLCPCB Part Class: Extended Part; Datasheet: https://www.ti.com/cn/lit/gpn/ads1014; Supplier: LCSC; resolution: 12 Bits; sampling frequency: 3300Hz; number of channels: 4; Supply Voltage: 2V~5.5V; Interface: I2C; differential input: Yes; Integral nonlinearity: 0.5LSB; Operating Temperature: -40℃~+125℃
U302 U306 = ZMPT101B: Current Ratio:- Current Rating:- High Potential:- Secondary Side Inductance:- DCR Primary Side (Max):- DCR Secondary Side (Max):-; Supplier Part: C111858; Manufacturer: 择明朗熙; Supplier Footprint: 插件; JLCPCB Part Class: Extended Part; Datasheet: https://atta.szlcsc.com/upload/public/pdf/source/20180620/C111858_8009DF6588FC1E1F0188704039E5D8C5.pdf; Supplier: LCSC
U303 U307 = ACS724LLCTR-10AB-T: Current Range:10A Current Range:10A Supply Voltage:4.5V~5.5V Supply Voltage:4.5V~5.5V Sensitivity:200mV/A Operating Temperature:-40℃~+150℃ Operating Temperature:-40℃~+150℃; LCSC Part Name: 电流传感器; Supplier Part: C99740; Manufacturer: ALLEGRO(美国埃戈罗); Supplier Footprint: SOIC-8; JLCPCB Part Class: Extended Part; Datasheet: https://atta.szlcsc.com/upload/public/pdf/source/20170412/1491969265302.pdf; Supplier: LCSC; Current Range: 10A; Supply Voltage: 4.5V~5.5V; Sensitivity: 200mV/A; Operating Temperature: -40℃~+150℃
U108 U304 U308 = ADS1115IDGSR: Interface:I2C differential input:Yes number of channels:2 Supply Voltage:2V~5.5V Supply Voltage:2V~5.5V sampling frequency:860Hz resolution:16Bit Operating Temperature:-40℃~+125℃ Operating Temperature:-40℃~+125℃; LCSC Part Name: 具有内部基准、振荡器和可编程比较器且兼容 I2C 的ADS111x、超小型、低功耗 860SPS、16位ADC; Supplier Part: C37593; Manufacturer: TI(德州仪器); Supplier Footprint: VSSOP-10; JLCPCB Part Class: Extended Part; Datasheet: https://www.ti.com/cn/lit/gpn/ads1115; Supplier: LCSC; Interface: I2C; differential input: Yes; number of channels: 2; Supply Voltage: 2V~5.5V; sampling frequency: 860Hz; resolution: 16Bit; Operating Temperature: -40℃~+125℃
C100 C202 C203 = 25V2200uF CD288: Capacitance:2200uF Tolerance:±20% Tolerance:±20% Voltage Rating:25V Ripple Current:- Equivalent Series Resistance(ESR):- Pin Spacing:5mm Diameter:- Height - Seated (Max):- Lifetime:- Operating Temperature:-40℃~+105℃ Operating Temperature:-40℃~+105℃; LCSC Part Name: 2200uF ±20% 25V; Supplier Part: C2960413; Manufacturer: HRK(鸿瑞凯电子); Supplier Footprint: 插件,D13xL20mm; JLCPCB Part Class: Extended Part; Datasheet: https://atta.szlcsc.com/upload/public/pdf/source/20220224/BAF93585A647890808BAE6D9E7A33364.pdf; Supplier: LCSC; Tolerance: ±20%; Voltage Rating: 25V; Pin Spacing: 5mm; Operating Temperature: -40℃~+105℃
D200-D203 = 1N4007_C126233: Diode Configuration:Independent Type Forward Voltage (Vf@If):1.1V@1A Reverse Voltage (Vr): Rectified Current: Reverse Leakage Current (Ir):5uA@1kV; LCSC Part Name: 停产; Supplier Part: C126233; Manufacturer: SHIKUES(时科); Supplier Footprint: SMA(DO-214AC); JLCPCB Part Class: Extended Part; Datasheet: https://atta.szlcsc.com/upload/public/pdf/source/20170818/C126233_1503051236073895256.pdf; Supplier: LCSC; Diode Configuration: Independent Type; Forward Voltage (Vf@If): 1.1V@1A; Reverse Leakage Current (Ir): 5uA@1kV
FH100 FH200 FH201 FH400 = PTF-15: Fuseholder Type:- Voltage Rating:250V Current Rating:6.3A Fuse Type:- Fuse Size:-; LCSC Part Name: 保险丝座 5x20mm 白色盖 二件套 两件套; Supplier Part: C842712; Manufacturer: XFCN(兴飞); JLCPCB Part Class: Extended Part; Datasheet: https://atta.szlcsc.com/upload/public/pdf/source/20211009/012EEC364944A1D424B5148AD750D865.pdf; Supplier: LCSC; Voltage Rating: 250V; Current Rating: 6.3A
L100 L200 L201 = XR6826T471MHL6: Inductance: Tolerance:±10% Tolerance:±10% Rated Current:2.8A Current - Saturation (Isat):6A Type:Magnetic ring inductance Wire Diameter:0.6mm; Supplier Part: C22447631; Manufacturer: XR(祥如); Supplier Footprint: 插件,D=22.5mm; JLCPCB Part Class: Extended Part; Datasheet: https://atta.szlcsc.com/upload/public/pdf/source/20240529/E0C5168BD2B6654E2D0299456D4E5B10.pdf; Supplier: LCSC; Tolerance: ±10%; Rated Current: 2.8A; Current - Saturation (Isat): 6A; Type: Magnetic ring inductance; Wire Diameter: 0.6mm
LED200 LED201 = NCD0805R1_C84256: Lamp Holder Type:- Emitted Color:Red Forward Voltage (VF):1.6V~2.6V Forward Voltage (VF):1.6V~2.6V Power Dissipation:65mW Forward Current:20mA Dominant Wavelength:615nm~630nm Dominant Wavelength:615nm~630nm Peak Wavelength:- Diode Configuration:独立二极管 Lens; LCSC Part Name: NCD0805R1; Supplier Part: C84256; Manufacturer: 国星光电; Manufacturer Part: NCD0805R1; Supplier Footprint: 0805; JLCPCB Part Class: Basic Part; Datasheet: https://atta.szlcsc.com/upload/public/pdf/source/20200820/C84256_F0A75A43B3EAD75808600A0514C76B99.pdf; Supplier: LCSC; Emitted Color: Red; Forward Voltage (VF): 1.6V~2.6V; Power Dissipation: 65mW; Forward Current: 20mA; Dominant Wavelength: 615nm~630nm; Diode Configuration: 独立二极管; Lens Color: 无色透明透镜; Luminous Intensity: 67mcd~195mcd; Viewing Angle: 130°; Operating Temperature: -30℃~+85℃
Q200 Q201 Q500-Q503 = BC847_C475630: Transistor Type: Collector Current (Ic): Collector-Emitter Breakdown Voltage (Vceo): Power Dissipation (Pd): DC Current Gain (hFE@Ic,Vce):110@2mA,5V DC Current Gain (hFE@Ic,Vce):110@2mA,5V Transition Frequency (fT):100MHz Collector Cut-Off Current (Icbo):; LCSC Part Name: NPN 电流:100mA 耐压:45V; Supplier Part: C475630; Manufacturer: SHIKUES(时科); Supplier Footprint: SOT-23; JLCPCB Part Class: Extended Part; Datasheet: https://atta.szlcsc.com/upload/public/pdf/source/20200102/C475632_1BD5CEE5FD46587CE970DDC94CF96264.pdf; Supplier: LCSC; DC Current Gain (hFE@Ic,Vce): 110@2mA,5V; Transition Frequency (fT): 100MHz; Collector Cut-Off Current (Icbo): 100nA; Collector-Emitter Saturation Voltage (VCE(sat)@Ic,Ib): 500mV@100mA,5mA
Q100-Q102 Q202-Q205 = IRL540NPBF: Type:1 N-Channel Drain Source Voltage (Vdss): Continuous Drain Current (Id): Drain Source On Resistance (RDS(on)@Vgs,Id):0.044Ω@10V,18A Power Dissipation (Pd): Gate Threshold Voltage (Vgs(th)@Id):1V@250uA Total Gate Charge (Qg@Vgs):74nC Input Capacitance; LCSC Part Name: 1个N沟道 耐压:100V 电流:36A; Supplier Part: C111607; Manufacturer: Infineon(英飞凌); Supplier Footprint: TO-220AB; JLCPCB Part Class: Extended Part; Datasheet: https://atta.szlcsc.com/upload/public/pdf/source/20170925/C111607_1506321340480990091.pdf; Supplier: LCSC; Type: 1 N-Channel; Drain Source On Resistance (RDS(on)@Vgs,Id): 0.044Ω@10V,18A; Gate Threshold Voltage (Vgs(th)@Id): 1V@250uA; Total Gate Charge (Qg@Vgs): 74nC; Input Capacitance (Ciss@Vds): 1.8nF; Reverse Transfer Capacitance (Crss@Vds): 170pF; Operating Temperature: -55℃~+175℃
R105 R110 R112 R113 R206 R208 R210 R211 R214-R216 R220 = RMC080501%N: Resistance: Tolerance:±1% Tolerance:±1% Power(Watts):-; LCSC Part Name: 0Ω ±1%; Supplier Part: C269738; Manufacturer: Tyohm(幸亚电阻); Supplier Footprint: 0805; JLCPCB Part Class: Extended Part; Datasheet: https://atta.szlcsc.com/upload/public/pdf/source/20190115/C325956_D27151D492FFB3C9AB4A6F14FE01F30A.pdf; Supplier: LCSC; Tolerance: ±1%
RLY200 RLY201 = SRD-05VDC-SL-C: Coil Voltage:5V Contact Form:一组转换:1C(SPDT-转换) Pin Number:5 Contact Rating:- Maximum Switching Voltage:250V@AC Coil Rated Power:360mW Maximum Switching Current:15A Coil Type:无极性-单线圈 Coil Resistance:70Ω Contact Resistance:100mΩ Operate Time:10ms Release Tim; LCSC Part Name: 蓝色; Supplier Part: C35449; Manufacturer: 松乐; Supplier Footprint: 插件,15.6x19.2mm; JLCPCB Part Class: Extended Part; Datasheet: https://atta.szlcsc.com/upload/public/pdf/source/20200305/C490149_C96E4098A3B1FFB377D5AD2E40B7C2A8.pdf; Supplier: LCSC; Coil Voltage: 5V; Contact Form: 一组转换:1C(SPDT-转换); Pin Number: 5; Maximum Switching Voltage: 250V@AC; Coil Rated Power: 360mW; Maximum Switching Current: 15A; Coil Type: 无极性-单线圈; Coil Resistance: 70Ω; Contact Resistance: 100mΩ; Operate Time: 10ms; Release Time: 10ms
U109 U110 U200 = XT60PW-F: Power:- Output:- Input:- Size:- Interface:- Type:- Colour:Yellow MaximumCurrent:- Type:卧式插头 RatedVoltage:- Type1:- NumberOfUSBHoles:- InterfaceType:母头 MetalMaterial:- InsulationMaterial:- RatedCurrent:- RecommendedWireGauge:- FlameRetardantGrade:- contact; LCSC Part Name: AMASS(艾迈斯)插头连接器锂电池组充电接口 航模电调卧式焊板 母头 XT60PW-F; Supplier Part: C428722; Manufacturer: AMASS(艾迈斯); JLCPCB Part Class: Extended Part; Datasheet: https://atta.szlcsc.com/upload/public/pdf/source/20190916/C428722_DFF78979486FCB0B58C1FC563067EC88.pdf; Supplier: LCSC; Type: 卧式插头; Colour: Yellow; InterfaceType: 母头
U100 U102 U104 U201-U203 U205 U207 U208 = SS34_C3011102: Diode Configuration:Single Forward Voltage (Vf@If):550mV@3A Reverse Voltage (Vr):40V Average Rectified Current (Io):3A Reverse Leakage Current (Ir):500uA@40V Peak forward surge current:100A; LCSC Part Name: 电压:40V 电流:3A; Supplier Part: C3011102; Manufacturer: JUXING(钜兴); Supplier Footprint: DO-214AC(SMA); JLCPCB Part Class: Extended Part; Datasheet: https://atta.szlcsc.com/upload/public/pdf/source/20220513/31A68D47C3F1477C52940047F004F17A.pdf; Supplier: LCSC; Diode Configuration: Single; Forward Voltage (Vf@If): 550mV@3A; Reverse Voltage (Vr): 40V; Average Rectified Current (Io): 3A; Reverse Leakage Current (Ir): 500uA@40V; Peak forward surge current: 100A
U103 U204 U206 = IR2103PBF: Driven Configuration:Half Bridge Load Type:MOSFET；IGBT Number of Drivers:2 Peak Output Current(sink):360mA Peak Output Current(source):210mA Supply Voltage:10V~20V Supply Voltage:10V~20V Rise Time:100ns Fall Time:50ns Operating Temperature:-40℃~+150℃@(Tj); Supplier Part: C23701; Manufacturer: Infineon(英飞凌); Supplier Footprint: PDIP-8; JLCPCB Part Class: Extended Part; Datasheet: https://atta.szlcsc.com/upload/public/pdf/source/20131225/1457706666532.pdf; Supplier: LCSC; Driven Configuration: Half Bridge; Load Type: MOSFET；IGBT; Number of Drivers: 2; Peak Output Current(sink): 360mA; Peak Output Current(source): 210mA; Supply Voltage: 10V~20V; Rise Time: 100ns; Fall Time: 50ns; Operating Temperature: -40℃~+150℃@(Tj)
H500 H501 = PZ254V-11-02P: Pin Structure:1x2P Pitch:2.54mm Row Spacing:- Circluar Pins/Square Pins:Policy Mounting Type:Straight Number of Rows:Single Row Number of Pins:2P Current Rating:- Voltage Rating (Max):- Length of Mating Pin:6mm Insulation Height:2.5mm Length of End Connec; LCSC Part Name: 1x2P 间距:2.54mm 方针 直插; Supplier Part: C492401; Manufacturer: XFCN(兴飞); Supplier Footprint: 插件,P=2.54mm; JLCPCB Part Class: Extended Part; Datasheet: https://atta.szlcsc.com/upload/public/pdf/source/20200309/C492401_A812433581A9B211A7FFA413ADDFF0E5.pdf; Supplier: LCSC; Pin Structure: 1x2P; Pitch: 2.54mm; Circluar Pins/Square Pins: Policy; Mounting Type: Straight; Number of Rows: Single Row; Number of Pins: 2P; Length of Mating Pin: 6mm; Insulation Height: 2.5mm; Length of End Connection Pin: 3mm; Contact Material: Brass; Operating Temperature: -40℃~+105℃; Color: Black
U500 U502 = ESP32-WROOM-32E-N4: LCSC Part Name: 通用型Wi-Fi+BT+BLE MCU模组; Supplier Part: C701341; Manufacturer: ESPRESSIF(乐鑫); Supplier Footprint: SMD,18x25.5mm; JLCPCB Part Class: Extended Part; Datasheet: https://atta.szlcsc.com/upload/public/pdf/source/20220601/0020821B65DE5740BBACA5FACC5CF3B6.pdf; Supplier: LCSC
U501 U503 = CH340C: Applications Function:Transceiver Protocol: Supply Voltage:3.3V；5V Supply Voltage:3.3V；5V Data Rate:2Mbps; LCSC Part Name: CH340C USB转串口芯片 CH340; Supplier Part: C84681; Manufacturer: WCH(南京沁恒); Supplier Footprint: SOP-16; JLCPCB Part Class: Extended Part; Datasheet: https://atta.szlcsc.com/upload/public/pdf/source/20240619/63986D8440D4E5267A77ACD891CC4DE3.pdf; Supplier: LCSC; Applications Function: Transceiver; Supply Voltage: 3.3V；5V; Data Rate: 2Mbps
USB500 USB501 = TYPE-C 16PIN 2MD(073): Connector Type:Type-C Standard:USB 3.1 Gender:Female Mounting Style:Horizontal attachment Number of Contacts:16P Number of Ports:1 Current Rating - Power (Max):5A Operating Temperature Range:-25℃~+85℃ Operating Temperature Range:-25℃~+85℃ Rated Voltage (M; LCSC Part Name: Type-C 母 卧贴; Supplier Part: C2765186; Manufacturer: SHOU HAN(首韩); Supplier Footprint: SMD; JLCPCB Part Class: Extended Part; Datasheet: https://atta.szlcsc.com/upload/public/pdf/source/20211123/39B17C16241EAC15C5E277BDA434118E.pdf; Supplier: LCSC; Connector Type: Type-C; Standard: USB 3.1; Gender: Female; Mounting Style: Horizontal attachment; Number of Contacts: 16P; Number of Ports: 1; Current Rating - Power (Max): 5A; Operating Temperature Range: -25℃~+85℃; Rated Voltage (Max): 5V; Connect-Disconnect Life: 5000 Cuts; Core Colour: Black
C108 C400 C408 C417 = KM477M025F12RR0VH2FP0: Capacitance:470uF Tolerance:±20% Tolerance:±20% Voltage Rating:25V Pin Spacing:3.5mm Diameter:8mm Height - Seated (Max):12mm Lifetime:2000hrs@105℃; LCSC Part Name: 470uF ±20% 25V; Supplier Part: C43839; Manufacturer: CX(承兴); Supplier Footprint: 插件,D8xL12mm; JLCPCB Part Class: Extended Part; Datasheet: https://atta.szlcsc.com/upload/public/pdf/source/20230915/80F12A3CAB98DAEEC2984174CA9E6511.pdf; Supplier: LCSC; Tolerance: ±20%; Voltage Rating: 25V; Pin Spacing: 3.5mm; Diameter: 8mm; Height - Seated (Max): 12mm; Lifetime: 2000hrs@105℃
U105 = LM5050MK-1/NOPB: Switch Type:High-side switch Number of Outputs:1 Control Input Logic:Active Low Output Current:- Input Voltage:1V~75V Input Voltage:1V~75V Resistor On-State:- Operating Temperature-:-40℃~+125℃ Operating Temperature-:-40℃~+125℃; LCSC Part Name: 高侧OR-ing场效应管控制器; Supplier Part: C129323; Manufacturer: TI(德州仪器); Supplier Footprint: TSOT-23-6; JLCPCB Part Class: Extended Part; Datasheet: https://www.ti.com/cn/lit/gpn/lm5050-1-q1; Supplier: LCSC; Switch Type: High-side switch; Number of Outputs: 1; Control Input Logic: Active Low; Input Voltage: 1V~75V; Operating Temperature	-: -40℃~+125℃
U107 = ACS724LLCTR-05AB-T: Current Range:5A Current Range:5A Supply Voltage:4.5V~5.5V Supply Voltage:4.5V~5.5V Sensitivity:400mV/A Operating Temperature:-40℃~+150℃ Operating Temperature:-40℃~+150℃; LCSC Part Name: 车规级、电磁隔离电流传感器IC，具有共模场抑制功能，采用小尺寸SOIC8封装; Supplier Part: C459328; Manufacturer: ALLEGRO(美国埃戈罗); Supplier Footprint: SOIC-8; JLCPCB Part Class: Extended Part; Datasheet: https://atta.szlcsc.com/upload/public/pdf/source/20200518/C459328_30972F681B164683FED19A924BE04160.pdf; Supplier: LCSC; Current Range: 5A; Supply Voltage: 4.5V~5.5V; Sensitivity: 400mV/A; Operating Temperature: -40℃~+150℃
DC400 = DC050-T: Connector Type:DC Power Receptacle Mounting Style:Horizontal attachment Inside Contact Diameter:2mm Outside Contact Diameter:6.4mm Current Rating (Max):2A Voltage Rating (Max):30V Operating Temperature Range:-25℃~+70℃ Operating Temperature Range:-25℃~+70℃; LCSC Part Name: DC电源插座 内径:2mm 外径:6.4mm; Supplier Part: C431534; Manufacturer: SHOU HAN(首韩); Supplier Footprint: SMD; JLCPCB Part Class: Extended Part; Datasheet: https://atta.szlcsc.com/upload/public/pdf/source/20241230/47AFDAED5CA2AEF49E0D72E48671546A.pdf; Supplier: LCSC; Connector Type: DC Power Receptacle; Mounting Style: Horizontal attachment; Inside Contact Diameter: 2mm; Outside Contact Diameter: 6.4mm; Current Rating (Max): 2A; Voltage Rating (Max): 30V; Operating Temperature Range: -25℃~+70℃
L400 L401 = SMDRI74-100NT: Inductance: Tolerance:±30% Tolerance:±30% Rated Current: Saturation Current (Isat):2.95A DC Resistance (DCR): Type:屏蔽电感; LCSC Part Name: 10uH ±30% 2.95A; Supplier Part: C58313; Manufacturer: SXN(顺翔诺); Supplier Footprint: SMD; JLCPCB Part Class: Extended Part; Datasheet: https://atta.szlcsc.com/upload/public/pdf/source/20210810/6F96FDC19AA308DD2AD166FFB9640E87.pdf; Supplier: LCSC; Tolerance: ±30%; Saturation Current (Isat): 2.95A; Type: 屏蔽电感
U400 U402 = MP2307DN-LF-Z: Function:Step-down type Output Type:Adjustable Input Voltage:4.75V~23V Input Voltage:4.75V~23V Output Voltage:925mV~20V Output Voltage:925mV~20V Output Current:3A Switching Frequency:- Switching Frequency:- Operating Temperature:-40℃~+85℃ Operating Temper; LCSC Part Name: 3A，23V，340KHz同步整流降压转换器; Supplier Part: C18921; Manufacturer: MPS(芯源); Supplier Footprint: SOIC-8N-EP-150mil; JLCPCB Part Class: Extended Part; Datasheet: https://atta.szlcsc.com/upload/public/pdf/source/20240607/BC28E61CD4865DE49D18FCC10A6443E8.pdf; Supplier: LCSC; Function: Step-down type; Output Type: Adjustable; Input Voltage: 4.75V~23V; Output Voltage: 925mV~20V; Output Current: 3A; Operating Temperature: -40℃~+85℃; Synchronous Rectification: Yes; Number of Outputs: 1; Topology: Step-down; Switch tube (built-in/external): Built-in
U401 = AMS1117-5.0_C917153: Output Type:Fixed Voltage - Supply:- Output Voltage:5V Output Voltage:5V Output Current:800mA Voltage Dropout:-; LCSC Part Name: AMS1117-5.0 SOT-223; Supplier Part: C917153; Manufacturer: JSMSEMI(杰盛微); Supplier Footprint: SOT-223-3; JLCPCB Part Class: Extended Part; Datasheet: https://atta.szlcsc.com/upload/public/pdf/source/20211201/578FEEF9766904D398893791CE3EC879.pdf; Supplier: LCSC; Output Type: Fixed; Output Voltage: 5V; Output Current: 800mA
U403 = AMS1117-3.3_C2891839: Output Type: Maximum Input Voltage:18V Output Voltage:3.3V Output Voltage:3.3V MAX Output Current:1A Power Supply Rejection Ratio (PSRR):60dB@(120Hz) Dropout Voltage:1.3V@(1A) standby current:5mA Noise:0.005%Vout Feature:- Operating Temperature:-40℃~+125℃; LCSC Part Name: 输入18V 输出3.3V 1A; Supplier Part: C2891839; Manufacturer: YONGYUTAI(永裕泰); Supplier Footprint: SOT-223-3; JLCPCB Part Class: Extended Part; Datasheet: https://atta.szlcsc.com/upload/public/pdf/source/20210901/A75ADDE6A17DEE0002F2A58A8D1F3634.pdf; Supplier: LCSC; Maximum Input Voltage: 18V; Output Voltage: 3.3V; MAX Output Current: 1A; Power Supply Rejection Ratio (PSRR): 60dB@(120Hz); Dropout Voltage: 1.3V@(1A); standby current: 5mA; Noise: 0.005%Vout; Operating Temperature: -40℃~+125℃@(Tj); Output Polarity: Positive electrode; Number of Outputs: 1

## Nets
+3.3V: C417.1 C500.1 C501.1 C502.1 C504.1 C505.1 C506.1 L101.2 L103.2 L300.2 L301.2 L302.2 L304.2 L307.2 L308.2 L310.2 Q103.1(G) Q104.1(G) Q105.1(G) Q300.1(G) Q301.1(G) Q302.1(G) Q303.1(G) Q304.1(G) Q305.1(G) R100.1 R101.1 R106.1 R109.1 R119.1 R120.1 R126.2 R129.1 R131.2 R132.1 R135.2 R300.1 R301.1 R305.1 R306.1 R312.2 R317.2 R326.2 R338.2 R342.2 R348.2 R500.1 R501.1 R502.2 R504.2 R511.1 R512.1 R515.1 R516.1 U403.2(VOUT) U403.4(VOUT) U500.2(3V3) U501.4(V3) U501.16(VCC) U502.2(3V3) U503.4(V3) U503.16(VCC)
+5V: C408.1 D202.1 D203.1 L102.2 L104.2 L105.2 L303.2 L305.2 L306.2 L309.2 L311.2 L312.2 R125.2 R130.2 R134.2 R311.2 R316.2 R325.2 R337.2 R341.2 R346.1 R347.2 RLY200.1 RLY201.4 U401.2(VOUT) U401.4(VOUT)
+12V: C103.1 C104.1 C204.1 C205.1 C206.1 C211.1 C400.1 C401.1 C402.1 C410.1 C411.1 FH400.1 R400.2 R404.2 U100.2 U103.1(VCC) U201.2 U202.2 U204.1(VCC) U206.1(VCC) U400.2(IN) U402.2(IN)
GND: C100.2 C101.1 C102.1 C103.2 C104.2 C107.2 C108.2 C109.2 C110.2 C111.2 C112.2 C113.2 C114.2 C115.2 C116.1 C117.1 C118.1 C119.1 C120.1 C200.1 C201.1 C202.2 C203.2 C204.2 C205.2 C206.2 C211.2 C300.2 C301.2 C302.2 C303.2 C305.1 C306.1 C307.2 C308.1 C309.1 C310.2 C311.1 C312.1 C313.1 C314.2 C316.1 C317.1 C318.2 C319.2 C320.2 C321.1 C322.1 C323.1 C324.1 C325.1 C400.2 C401.2 C402.2 C403.1 C404.2 C405.2 C409.1 C410.2 C411.2 C412.1 C413.2 C414.2 C417.2 C418.1 C500.2 C501.2 C502.2 C503.1 C504.2 C505.2 C506.2 C507.1 DC400.2 DC400.3 Q102.3(S) Q200.2(E) Q201.2(E) Q204.3(S) Q205.3(S) R102.1 R104.1 R108.1 R114.1 R115.1 R117.1 R121.1 R122.1 R124.1 R137.2 R204.1 R205.1 R217.1 R218.1 R222.1 R223.1 R224.1 R225.1 R302.1 R304.1 R307.1 R313.1 R320.2 R321.2 R323.2 R328.2 R329.1 R335.2 R336.2 R339.1 R343.2 R350.2 R401.1 R402.2 R405.1 R406.2 R505.2 R506.2 R508.1 R509.1 R510.1 R513.2 R514.2 R519.1 R520.1 R521.1 U101.6(GND) U103.4(COM) U105.2(GND) U105.3(OFF) U106.6(GND) U107.5(GND) U108.3(GND) U108.6(AIN2) U108.7(AIN3) U109.1 U109.2 U109.4(-) U110.1 U110.2 U110.4(-) U200.1 U200.2 U204.4(COM) U206.4(COM) U300.6(GND) U301.3(GND) U301.6(AIN2) U301.7(AIN3) U302.3 U303.5(GND) U304.3(GND) U304.6(AIN2) U304.7(AIN3) U305.3(GND) U305.6(AIN2) U305.7(AIN3) U306.3 U307.5(GND) U308.3(GND) U308.6(AIN2) U308.7(AIN3) U400.4(GND) U400.9(EXP) U401.1(GND) U402.4(GND) U402.9(EXP) U403.1(ADJ(GND)) U500.1(GND) U500.15(GND) U500.38(GND) U500.39(GND) U501.1(GND) U502.1(GND) U502.15(GND) U502.38(GND) U502.39(GND) U503.1(GND) USB500.1(GND) USB500.12(GND) USB500.13(SHELL) USB500.14(SHELL) USB501.1(GND) USB501.12(GND) USB501.13(SHELL) USB501.14(SHELL)
BAT-P: FH100.2 R303.2 U107.3(IP–) U107.4(IP–) U300.8(IN+)
FIL-L: C207.1 C208.1 L200.1 Q202.3(S) Q204.2(D) R212.1 U204.6(VS)
FIL-N: C209.1 C210.1 L201.1 Q203.3(S) Q205.2(D) R213.1 U206.6(VS)
GRID-LV-L: FH200.1 R201.2 R334.2 RLY200.2
GRID-LV-N: FH201.1 LED201.2(-) RLY201.2 U306.2
GTI-BOOT: Q503.3(C) U502.25(IO0)
GTI-EN: C507.2 Q502.3(C) R515.2 U502.3(EN)
GTI-G-ALERT: U305.2(ALERT/RDY) U502.37(IO23)
GTI-H-ALERT: Q303.2(S) R338.1 U502.26(IO4)
GTI-HIN-L: R210.1 U502.8(IO32)
GTI-HIN-N: R214.1 U502.11(IO26)
GTI-I-ALERT: Q300.2(S) R312.1 U502.7(IO35)
GTI-NLIN-L: R211.1 U502.9(IO33)
GTI-NLIN-N: R215.1 U502.10(IO25)
GTI-P-1: R303.1 U300.7(IN–) U307.1(IP+) U307.2(IP+)
GTI-P-2: C200.2 C201.2 C202.1 C203.1 Q202.2(D) Q203.2(D) U307.3(IP-) U307.4(IP-)
GTI-RELAY-L: R202.1 U502.12(IO27)
GTI-RELAY-N: R203.1 U502.16(IO13)
GTI-RX: U502.34(RXD0) U503.2(TXD)
GTI-SCL-1: Q301.2(S) R317.1 R332.1 U305.10(SCL) U502.36(IO22)
GTI-SCL-2: Q304.2(S) R306.2 R310.1 R342.1 U300.4(SCL) U301.10(SCL) U502.30(IO18)
GTI-SDA-1: Q302.2(S) R326.1 R331.1 U305.9(SDA) U502.33(IO21)
GTI-SDA-2: Q305.2(S) R305.2 R309.1 R348.1 U300.3(SDA) U301.9(SDA) U502.31(IO19)
GTI-TX: R516.2 U502.35(TXD0) U503.3(RXD)
GTI-U-ALERT: U301.2(ALERT/RDY) U502.6(IO34)
INVERT-L: C212.1 C213.1 C214.1 C215.1 C216.1 C217.1 C218.1 C219.1 C220.1 L200.2 U303.1(IP+) U303.2(IP+)
INVERT-L-2: R318.2 RLY200.5 U303.3(IP-) U303.4(IP-)
INVERT-N: C212.2 C213.2 C214.2 C215.2 C216.2 C217.2 C218.2 C219.2 C220.2 L201.2 RLY201.5 U302.2
MPPT-ALERT: Q103.2(S) R126.1 U500.8(IO32)
MPPT-BOOT: Q501.3(C) U500.25(IO0)
MPPT-EN: C503.2 Q500.3(C) R500.2 U500.3(EN)
MPPT-HIN: R110.1 U500.31(IO19)
MPPT-NLIN: R112.1 U500.30(IO18)
MPPT-P-1: Q101.2(D) R118.1 R123.2 U105.6(OUT) U106.8(IN+)
MPPT-P-2: R123.1 U106.7(IN–) U107.1(IP+) U107.2(IP+)
MPPT-RX: U500.34(RXD0) U501.2(TXD)
MPPT-SCL: Q104.2(S) R109.2 R131.1 R132.2 U101.4(SCL) U106.4(SCL) U500.36(IO22)
MPPT-SDA: Q105.2(S) R106.2 R129.2 R135.1 U101.3(SDA) U106.3(SDA) U500.33(IO21)
MPPT-TX: R501.2 U500.35(TXD0) U501.3(RXD)
SOL-P-1: R103.2 U101.8(IN+) U109.3(+)
SOL-P-2: C100.1 C101.2 C102.2 Q100.2(D) R103.1 U101.7(IN–)
SOL-P-IN: FH100.1 U110.3(+)
$1N1341: R206.1 U203.2
$1N1345: R207.1 U203.1 U204.7(HO)
$1N1350: Q202.1(G) R206.2 R207.2 R212.2
$1N1510: R216.1 U207.2
$1N1512: R219.1 U204.5(LO) U207.1
$1N1515: Q204.1(G) R216.2 R219.2 R224.2
$1N1590: C207.2 C208.2 U201.1 U204.8(VB)
$1N1796: R210.2 R217.2 U204.2(HIN)
$1N1800: R211.2 R218.2 U204.3(LIN#)
$1N2660: R208.1 U205.2
$1N2662: R209.1 U205.1 U206.7(HO)
$1N2668: Q203.1(G) R208.2 R209.2 R213.2
$1N2675: R220.1 U208.2
$1N2677: R221.1 U206.5(LO) U208.1
$1N2683: Q205.1(G) R220.2 R221.2 R225.2
$1N2698: C209.2 C210.2 U202.1 U206.8(VB)
$1N2721: R214.2 R223.2 U206.2(HIN)
$1N2725: R215.2 R222.2 U206.3(LIN#)
$1N57714: D202.2 Q200.3(C) RLY200.4
$1N57911: Q200.1(B) R202.2 R204.2
$1N60515: R200.2 RLY200.3
$1N60926: D203.2 Q201.3(C) RLY201.1
$1N60927: LED200.2(-) RLY201.3
$1N60929: Q201.1(B) R203.2 R205.2
$1N61013: D200.1 LED200.1(+)
$1N61015: D200.2 R200.1
$1N61140: D201.1 LED201.1(+)
$1N61142: D201.2 R201.1
$1N68343: FH200.2 U200.3(+)
$1N68348: FH201.2 U200.4(-)
$2N8211: R318.1 U302.1
$2N8300: C304.1 R320.1 U302.4
$2N8526: C302.1 L301.1 R314.1
$2N8586: C304.2 R314.2 R321.1 U301.4(AIN0)
$2N9694: C305.2 C306.2 L302.1 R308.2 U301.8(VDD)
$2N10082: R323.1 R324.1 U301.5(AIN1)
$2N10087: C310.1 L304.1 R324.2
$2N14080: R349.1 R350.1 U308.5(AIN1)
$2N14081: Q303.3(D) R337.1 U308.2(ALERT/RDY)
$2N14091: C323.2 U307.7(VIOUT) U308.4(AIN0)
$2N14092: C318.1 C320.1 L309.1 U307.8(VCC)
$2N14094: C321.2 U307.6(FILTER)
$2N14100: Q304.3(D) R340.2 R341.1 U308.10(SCL)
$2N14110: C324.2 L311.1 R349.2
$2N18643: R339.2 R340.1 R345.2 R346.2 U308.1(ADDR)
$2N18723: Q305.3(D) R345.1 R347.1 U308.9(SDA)
$2N21518: R301.2 R302.2 U300.1(A1)
$2N21519: R300.2 R304.2 U300.2(A0)
$2N21529: C300.1 C301.1 L300.1 U300.5(VS)
$2N21835: R307.2 R308.1 R309.2 R310.2 U301.1(ADDR)
$2N22828: C316.2 C317.2 L308.1 R330.2 U305.8(VDD)
$2N22844: C319.1 L310.1 R344.2
$2N22845: R343.1 R344.1 U305.5(AIN1)
$2N22854: R329.2 R330.1 R331.2 R332.2 U305.1(ADDR)
$2N22872: C315.1 R335.1 U306.4
$2N22873: R334.1 U306.1
$2N22874: C314.1 L307.1 R333.1
$2N22881: C315.2 R333.2 R336.1 U305.4(AIN0)
$2N24172: Q302.3(D) R319.1 R325.1 U304.9(SDA)
$2N24173: C309.2 C313.2 L306.1 R322.1 U304.8(VDD)
$2N24176: Q301.3(D) R315.2 R316.1 U304.10(SCL)
$2N24178: C312.2 L305.1 R327.2
$2N24181: R327.1 R328.1 U304.5(AIN1)
$2N24182: R313.2 R315.1 R319.2 R322.2 U304.1(ADDR)
$2N24187: Q300.3(D) R311.1 U304.2(ALERT/RDY)
$2N24188: C311.2 U303.7(VIOUT) U304.4(AIN0)
$2N24193: C308.2 U303.6(FILTER)
$2N24194: C303.1 C307.1 L303.1 U303.8(VCC)
$2N32734: C322.2 C325.2 L312.1 U308.8(VDD)
$3N2190: Q501.1(B) R507.2
$3N2191: Q500.1(B) R503.2
$3N2192: Q501.2(E) R503.1 U501.13(DTR#)
$3N2193: Q500.2(E) R507.1 U501.14(RTS#)
$3N2208: R508.2 USB500.10(CC2)
$3N2209: R510.2 USB500.4(CC1)
$3N2211: U501.6(D-) USB500.5(DN2) USB500.7(DN1)
$3N2212: U501.5(D+) USB500.6(DP1) USB500.8(DP2)
$3N2213: R509.2 USB500.2(VBUS) USB500.11(VBUS)
$3N2215: Q503.1(B) R518.2
$3N2216: Q502.1(B) R517.2
$3N2217: Q503.2(E) R517.1 U503.13(DTR#)
$3N2218: Q502.2(E) R518.1 U503.14(RTS#)
$3N2233: R519.2 USB501.10(CC2)
$3N2234: R521.2 USB501.4(CC1)
$3N2236: U503.6(D-) USB501.5(DN2) USB501.7(DN1)
$3N2237: U503.5(D+) USB501.6(DP1) USB501.8(DP2)
$3N2238: R520.2 USB501.2(VBUS) USB501.11(VBUS)
$3N5677: H500.1 U500.28(IO17)
$3N5683: H500.2 U500.27(IO16)
$3N6199: H501.1 U502.28(IO17)
$3N6203: H501.2 U502.27(IO16)
$3N8095: R502.1 R506.1 U500.6(IO34)
$3N8103: R504.1 R505.1 U500.7(IO35)
$3N8114: R512.2 R514.1 U502.4(SENSOR_VP)
$3N8121: R511.2 R513.1 U502.5(SENSOR_VN)
$4N1239: R105.1 U102.2
$4N1240: R107.1 U102.1 U103.7(HO)
$4N1241: Q100.1(G) R105.2 R107.2 R111.2
$4N1242: R113.1 U104.2
$4N1243: R116.1 U103.5(LO) U104.1
$4N1244: Q102.1(G) R113.2 R116.2 R117.2
$4N1245: C105.1 C106.1 L100.1 Q100.3(S) Q102.2(D) R111.1 U103.6(VS)
$4N1246: C105.2 C106.2 U100.1 U103.8(VB)
$4N1250: R110.2 R114.2 U103.2(HIN)
$4N1251: R112.2 R115.2 U103.3(LIN#)
$4N1259: C108.1 C109.1 C110.1 L100.2 Q101.3(S) R108.2 U105.4(IN)
$4N1261: Q101.1(G) U105.5(GATE)
$4N1263: R118.2 U105.1(VS)
$4N3802: R100.2 R104.2 U101.2(A0)
$4N3803: R101.2 R102.2 U101.1(A1)
$4N3814: R119.2 R124.2 U106.2(A0)
$4N3815: R120.2 R122.2 U106.1(A1)
$4N3954: C107.1 C111.1 L101.1 U101.5(VS)
$4N4114: C113.1 C115.1 L103.1 U106.5(VS)
$4N5397: Q104.3(D) R127.2 R130.1 U108.10(SCL)
$4N5402: Q105.3(D) R128.1 R134.1 U108.9(SDA)
$4N5403: C117.2 C119.2 L105.1 R133.1 U108.8(VDD)
$4N5411: C112.1 C114.1 L102.1 U107.8(VCC)
$4N5412: C120.2 U107.7(VIOUT) U108.4(AIN0)
$4N5413: Q103.3(D) R125.1 U108.2(ALERT/RDY)
$4N5417: R136.1 R137.1 U108.5(AIN1)
$4N5422: C116.2 U107.6(FILTER)
$4N5425: C118.2 L104.1 R136.2
$4N5623: R121.2 R127.1 R128.2 R133.2 U108.1(ADDR)
$5N1461: C406.2 U400.1(BS)
$5N1462: C406.1 L400.2 U400.3(SW)
$5N1464: C407.1 R401.2
$5N1465: C407.2 U400.6(COMP)
$5N1466: R400.1 U400.7(EN)
$5N1469: C403.2 U400.8(SS)
$5N1470: R402.1 R403.1 U400.5(FB)
$5N1474: C415.2 U402.1(BS)
$5N1475: C415.1 L401.2 U402.3(SW)
$5N1477: C416.1 R405.2
$5N1478: C416.2 U402.6(COMP)
$5N1479: R404.1 U402.7(EN)
$5N1482: C412.2 U402.8(SS)
$5N1483: C413.1 C414.1 C418.2 L401.1 R407.2 U403.3(VIN)
$5N1484: R406.1 R407.1 U402.5(FB)
$5N1493: C404.1 C405.1 C409.2 L400.1 R403.2 U401.3(VIN)
$5N2490: DC400.1 FH400.2

Not connected (* = marked no-connect by the designer): C408 2; U500 4(SENSOR_VP)* 5(SENSOR_VN)* 9(IO33)* 10(IO25)* 11(IO26)* 12(IO27)* 13(IO14)* 14(IO12)* 16(IO13)* 17(NC)* 18(NC)* 19(NC)* 20(NC)* 21(NC)* 22(NC)* 23(IO15)* 24(IO2)* 26(IO4)* 29(IO5)* 32(NC)* 37(IO23)*; U501 7(NC.)* 8(OUT#)* 9(CTS#)* 10(DSR#)* 11(RI#)* 12(DCD#)* 15(R232)*; U502 13(IO14)* 14(IO12)* 17(NC)* 18(NC)* 19(NC)* 20(NC)* 21(NC)* 22(NC)* 23(IO15)* 24(IO2)* 29(IO5)* 32(NC)*; U503 7(NC.)* 8(OUT#)* 9(CTS#)* 10(DSR#)* 11(RI#)* 12(DCD#)* 15(R232)*; USB500 3(SBU2)* 9(SBU1)*; USB501 3(SBU2)* 9(SBU1)*

## Notes on the sheets
sheet 1
- Relays
- Grid
- Connector directly to transformer LV side,
  HV connected to grid via Variac + Fuse
- 10A fuse
- Status leds:
    Red -> Inverter untied to grid
    Green -> Grid present on LV
- H Bridge
- LC Filter
sheet 2
- INA219 H Bridge Input
- 0.32W at 4A
  0 Ohm if ACS712 used
- AC Voltage sensor inverter
- Input: max 10Vrms
  10/0.002=5Kohm
  Output: 1.5V peak (3Vpp)
  1.5/0.002=750ohm
- ACS724 Inverter AC
- Differential
  mode 1.65V
- Differential
  mode 2.5V
- AC Voltage sensor grid
- Input: max 10Vrms
  10/0.002=5Kohm
  Output: 1.5V peak (3Vpp)
  1.5/0.002=750ohm
- ACS724 H Bridge Input
- Differential
  mode 1.65V
- Differential
  mode 2.5V
sheet 3
- ESP32 MPPT
- USB - UART MPPT
- NTC1
- NTC2
- TX
- UART
- RX
- ESP32 GTI
- I2C mapping:
  - Voltage Grid AC -> I2C1
  - Voltage Inv AC -> I2C2
  - Current Inv AC -> I2C1
  - Voltage Inv DC -> I2C2
  - Current Inv DC -> I2C2
- NTC2
- NTC1
- USB - UART GTI
- TX
- UART
- RX
- Special pins:
  - 0 boot mode
  - 2 must be low/float during flashing
  - 5 strapping pin -> pwm during boot
  - 12 strapping pin -> fails boot if pulled high
  - 14 pwm during boot
  - 15 pwm during boot -> strapping pin
  - 34/35/36/39 -> input only
sheet 4
- INA219 Solar Input
- MPPT
- Voltage probe point
- 0.2W at 2A
- INA219 Solar Output
- ACS724 MPPT Output
- 0.32W at 4A
  0 Ohm if ACS712 used
- Differential
  mode 2.5V
- Solar panel
- Battery
sheet 5
- 12V supply
- 1A
- 5V supply
- feedback
  for 6.5V
- 3.3V supply
- feedback
  for 4.8V
sheet 6
- MPPT
- GTI
- ACS724 (I)
  5A
- ACS724 10A
  (I DC)
- PV Panel
  (20V, 2A)
- INA219 (U+I)
- Synchronous Buck
  Half Bridge
- H Bridge
- LC Filter
- ACS724 10A
  (I AC)
- Relay
  (2x)
- LV
- Transformer
  7.18Vac - 230Vac
- INA219 (U)
- INA219
  (U DC)
- HV
- ZMPT 101B
  (U AC)
- ZMPT 101B
  (U AC)
- ESP32
- Battery
  10V - 14V
- Variac
- ESP32
- Grid
